# Altium project POTENCIOSTATO_REV12.PrjPcb (part 1 of 2)
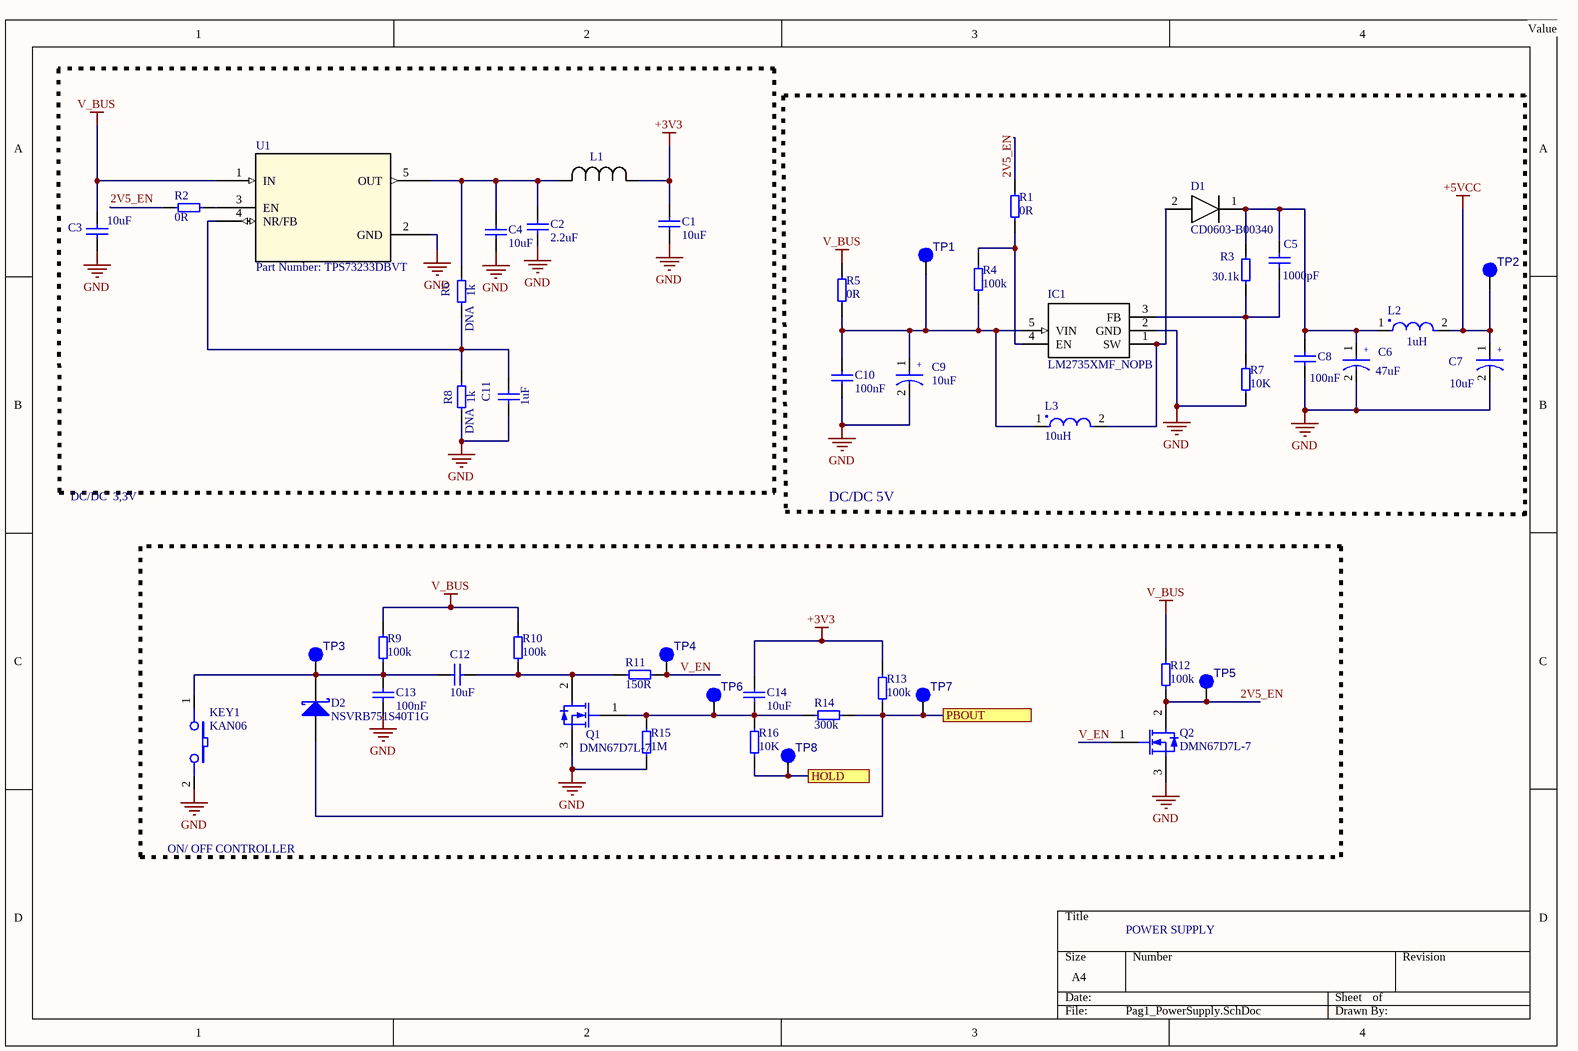
[diagram p0: Pag1_PowerSupply.SchDoc]
REFERENCIA: POTENCIOSTATO; REVISAO: REV1.2
5 sheets, 246 parts. Net scope: flat (ports and power ports of the same name join across sheets).
Board files: PCB_POTENTIOSTAT.PcbDoc, PCB_POTENTIOSTAT_P.PcbDoc
Sheets:
  Pag1_PowerSupply.SchDoc
  Pag2_Battery_Charger.SchDoc
  Pag3_Front_end_adc_dac.SchDoc
  Pag4_Processador.SchDoc
  Pag5_Perifericos.SchDoc

## Sheet Pag1_PowerSupply.SchDoc
size A4

### Parts
C1  10uF  [0603]
C2  2.2uF  [0603]
C3  10uF  [0603]
C4  10uF  [0603]
C5  1000pF  [0603]
C6  47uF  [0805]
C7  10uF  [CAP_6.6X6.6]
C8  100nF  [0603]
C9  10uF  [CAP_6.6X6.6]
C10  100nF  [0603]
C11  1uF  [0603]
C12  10uF  [0603]
C13  100nF  [0603]
C14  10uF  [0603]
D1  CD0603-B00340  [DIOM179X85N]
D2  NSVRB751S40T1G  [D_SOD523]
IC1  LM2735XMF_NOPB  [SOT95P280X145-5N]
KEY1  KAN06  [KAN06_v2]
L1  Part Number: MLZ2012A3R3WT000  [IND_2012]  (value not drawn)
L2  1uH  [SRP4012TA]
L3  10uH  [SRP4012TA]
Q1  DMN67D7L-7  [D_SOT23]
Q2  DMN67D7L-7  [D_SOT23]
R1  0R  [0603]
R2  0R  [0603]
R3  30.1k  [0603]
R4  100k  [0603]
R5  0R  [0603]
R6  1k  PCBA: DNA  [0603]
R7  10K  [0603]
R8  1k  PCBA: DNA  [0603]
R9  100k  [0603]
R10  100k  [0603]
R11  150R  [0603]
R12  100k  [0603]
R13  100k  [0603]
R14  300k  [0603]
R15  1M  [0603]
R16  10K  [0603]
TP1  Test Point  [TEST]  (value not drawn)
TP2  Test Point  [TEST]  (value not drawn)
TP3  Test Point  [TEST]  (value not drawn)
TP4  Test Point  [TEST]  (value not drawn)
TP5  Test Point  [TEST]  (value not drawn)
TP6  Test Point  [TEST]  (value not drawn)
TP7  Test Point  [TEST]  (value not drawn)
TP8  Test Point  [TEST]  (value not drawn)
U1  Part Number: TPS73233DBVT  [DBV5]

### Blocks framed on the sheet
DC/DC 5V: C5-C10 D1 IC1 L2 L3 R1 R3-R5 R7 TP1 TP2
ON/ OFF CONTROLLER: C12-C14 D2 KEY1 Q1 Q2 R9-R16 TP3-TP8

### Ports
HOLD, PBOUT

### Nets
+3V3: C1.2 C14.1 L1.1 R13.2
+5VCC: C7.1 L2.2 TP2.1(TP)
GND: C1.1 C2.1 C3.1 C4.1 C6.2 C7.2 C8.1 C9.2 C10.1 C11.1 C13.1 IC1.2(GND) KEY1.2 Q1.3(S) Q2.3(S) R7.1 R8.2 R15.2 U1.2(GND)  [project net EXT_GND_DETECT]
V_BUS: C3.2 R5.2 R9.2 R10.2 R12.2 U1.1(IN)
2V5_EN: Q2.2(D) R1.2 R2.2 R12.1 TP5.1(TP)
V_EN: Q2.1(G) R11.1 TP4.1(TP)
NetC2_2: C2.2 C4.2 L1.2 R6.1 U1.5(OUT)
NetC5_1: C5.1 IC1.3(FB) R3.1 R7.2
NetC5_2: C5.2 C6.1 C8.2 D1.1(K) L2.1 R3.2
NetC9_1: C9.1 C10.2 IC1.5(VIN) L3.1 R4.1 R5.1 TP1.1(TP)
NetC11_2: C11.2 R6.2 R8.1 U1.4(NR/FB)
NetC12_1: C12.1 Q1.2(D) R10.1 R11.2
NetC12_2: C12.2 C13.2 D2.K KEY1.1 R9.1 TP3.1(TP)
NetC14_2: C14.2 Q1.1(G) R14.1 R15.1 R16.1 TP6.1(TP)
NetD1_2: D1.2(A) IC1.1(SW) L3.2
NetD2_A: D2.A R13.1 R14.2 TP7.1(TP) ; port PBOUT
NetIC1_4: IC1.4(EN) R1.1 R4.2
NetR2_1: R2.1 U1.3(EN)
NetR16_2: R16.2 TP8.1(TP) ; port HOLD

### Notes on the sheet
- Value
- DC/DC  3,3V
- POWER SUPPLY
- (in symbol Cap Pol) +
- (in symbol Cap Pol_1) +

### Library data of the parts
C1 C4 = Cap: Multilayer Ceramic Capacitors MLCC - SMD/SMT 10uF 0603 10V 10%; Manufacturer: Murata Electronics; MPN: GRM188R61A106KE69D; PCBA: Assembly; Moeda: Dólar; NCM: 85322410; Datasheet: https://www.mouser.com/datasheet/2/281/murata_03052018_GRM_Series_1-1310166.pdf; Value: 10uF; Link/Contato: https://octopart.com/grm188r61a106ke69d-murata-22851381?r=sp; Supplier: Mouser
C2 = CAP_1uF: Multilayer Ceramic Capacitors MLCC - SMD/SMT 2.2uF 0603 16V 20%; Manufacturer: Wurth Electronics; MPN: 885012106018; PCBA: Assembly; Moeda: Dólar; NCM: 85322410; Datasheet: https://www.mouser.com/datasheet/2/445/885012106018-1727438.pdf; Value: 2.2uF; Link/Contato: https://octopart.com/885012106018-wurth+elektronik-53914723?r=sp; Supplier: Mouser
C3 = CAP_1uF: Multilayer Ceramic Capacitors MLCC - SMD/SMT 10uF 0603 10V 10%; Manufacturer: Murata Electronics; MPN: GRM188R61A106KE69D; PCBA: Assembly; Moeda: Dólar; NCM: 85322410; Datasheet: https://www.mouser.com/datasheet/2/212/KEM_C1006_X5R_SMD-1103249.pdf; Value: 10uF; Link/Contato: https://octopart.com/grm188r61a106ke69d-murata-22851381?r=sp; Supplier: Mouser
C5 = Cap_1: Capacitor Ceramic 1000pF 10% 16V 0603 (1608 Metric); MPN: 06033C102KAT2A; Manufacturer: Kyocera AVX; PCBA: Assembly; Moeda: Dólar; NCM: 85322410; Value: 1000pF; Link/Contato: https://octopart.com/06033c102kat2a-avx-2374779?r=sp; Supplier: Mouser
C6 = Cap Pol: Multilayer Ceramic Capacitors MLCC - SMD/SMT 47uF 0805 10V 20%; Manufacturer: Murata Electronics; MPN: GRM21BR61A476ME15K; PCBA: Assembly; Moeda: Dólar; NCM: 85322410; Value: 47uF; Link/Contato: https://octopart.com/grm21br61a476me15k-murata-46693540?r=sp; Supplier: Mouser
C7 C9 = Cap Pol_1: Capacitor Electrolytic 10uF 20% 16V; MPN: UUQ1C100MCL1GB; Manufacturer: Murata Electronics; PCBA: Assembly; Moeda: Dólar; NCM: 85322200; Value: 10uF; Link/Contato: https://octopart.com/uuq1c100mcl1gb-nichicon-19118150?r=sp; Supplier: Mouser
C8 C10 C13 = Cap_1: Multilayer Ceramic Capacitors MLCC - SMD/SMT 100nF 16V 0603 10%; MPN: C0603C104K4RACTU; Manufacturer: Kemet; PCBA: Assembly; Moeda: Dólar; NCM: 85322410; Value: 100nF; Link/Contato: https://octopart.com/c0603c104k4ractu-kemet-93067?r=sp; Supplier: Mouser
C11 = CAP_1uF: Multilayer Ceramic Capacitors MLCC - SMD/SMT 1uF 25V 0603 10%; Manufacturer: Samsung Electro-Mechanics; MPN: CL10A105KA8NNNC; PCBA: Assembly; Moeda: Dólar; NCM: 85322410; Datasheet: https://www.mouser.com/datasheet/2/445/885012106022-553988.pdf; Value: 1uF; Link/Contato: https://octopart.com/cl10a105ka8nnnc-samsung-9300957?r=sp; Supplier: Mouser
C12 C14 = Cap: Multilayer Ceramic Capacitors MLCC - SMD/SMT 10uF 0603 10V 10%; MPN: GRM188R61A106KE69D; Manufacturer: Murata Electronics; PCBA: Assembly; Moeda: Dólar; NCM: 85322410; Value: 10uF; Link/Contato: https://octopart.com/grm188r61a106ke69d-murata-22851381?r=sp; Supplier: Mouser
D1 = CD0603-B00340: Diode; MPN: CDBU0130R; Manufacturer: Comchip Technology; PCBA: Assembly; Moeda: Dólar; NCM: 85412120; Value: CD0603-B00340; Datasheet: https://datasheet.datasheetarchive.com/originals/distributors/Datasheets-DGA23/1390916.pdf; Link/Contato: https://octopart.com/cdbu0130r-comchip-19043158?r=sp; Supplier: Mouser
D2 = Schottky Diode: Schottky Diodes & Rectifiers SS 40V SHTKY SOD523; Manufacturer: onsemi; PCBA: Assembly; Moeda: Dólar; NCM: 85412120; MPN: NSVRB751S40T1G; Value: NSVRB751S40T1G; Link/Contato: https://octopart.com/nsvrb751s40t1g-onsemi-54318045?r=sp; Supplier: Mouser
IC1 = LM2735XMF_NOPB: Integrated Circuit; MPN: LM2735XMF/NOPB; Manufacturer: Texas Instruments; PCBA: Assembly; Moeda: Dólar; NCM: 85423120; Value: LM2735XMF_NOPB; Datasheet: http://www.ti.com/lit/ds/symlink/lm2735.pdf; Link/Contato: https://octopart.com/lm2735xmf%2Fnopb-texas+instruments-24813274?r=sp; Supplier: Mouser
KEY1 = SDS: Manufacturer: Metaltex; PCBA: Assembly; Moeda: Dólar; NCM: 85365090; Observações: Alternativo: TS11-674-73-BK-100-RA-D; Datasheet: www.metaltex.com.br/assets/produtos/pdf/a0.pdf; MPN: KAN06; Value: KAN06; Supplier: Mouser
L1 = MLZ2012A3R3WT000: No Description Available; Manufacturer: TDK; PCBA: DNA; Moeda: Dólar; NCM: 85045000; MPN: MLZ2012A3R3WT000; Datasheet: https://www.mouser.com/datasheet/2/400/nductor_commercial_decoupling_mlz2012_en-918301.pdf; Value: MLZ2012A3R3WT000; Link/Contato: https://octopart.com/mlz2012a3r3wt000-tdk-34829259?r=sp; Supplier: Mouser
L2 = IC_1uH: Power Inductors - SMD 1uH 20% SMD 4012 AEC-Q200; Manufacturer: Bourns; MPN: SRP4012TA-1R0M; PCBA: DNA; Value: 1uH 20%; Moeda: Dólar; NCM: 85045000; Datasheet: https://www.mouser.com/datasheet/2/54/rp4012ta-1391620.pdf; Link/Contato: https://octopart.com/srp4012ta-1r0m-bourns-47284976?r=sp; Supplier: Mouser
L3 = IC_1uH: Power Inductors - SMD 10uH 20% SMD 4012 AEC-Q200; Manufacturer: Bourns; MPN: SRP4012TA-100M; PCBA: Assembly; Moeda: Dólar; NCM: 85045000; Datasheet: https://www.mouser.com/datasheet/2/54/rp4012ta-1391620.pdf; Value: 10uH 20%; Link/Contato: https://octopart.com/srp4012ta-1r0m-bourns-47284976?r=sp; Supplier: Mouser
Q1 Q2 = MOSFET N-Ch: MOSFET BVDSS: 41V-60V; Manufacturer: Diodes Incorporated; PCBA: Assembly; Moeda: Dólar; NCM: 85412120; MPN: DMN67D7L-7; Value: DMN67D7L-7; Link/Contato: https://octopart.com/dmn67d7l-7-diodes+inc.-88723828?r=sp; Supplier: Mouser
R1 R5 = Res_1: Thick Film Resistors - SMD 0 Ohms 100 mW 0603 5%; MPN: RC0603JR-070RL; Manufacturer: Yageo; PCBA: Assembly; Moeda: Dólar; NCM: 85332120; Value: 0R; Link/Contato: https://octopart.com/rc0603jr-070rl-yageo-1241539?r=sp; Supplier: Mouser
R2 = Res: Thick Film Resistors - SMD 0 Ohms 100 mW 0603 5%; MPN: RC0603JR-070RL; Manufacturer: Yageo; PCBA: Assembly; Moeda: Dólar; NCM: 85332120; Value: 0R; Link/Contato: https://octopart.com/rc0603jr-070rl-yageo-1241539?r=sp; Supplier: Mouser
R3 = Res_1: Resistor Thick Film 30.1k 1% 0.1W, 1/10W 0603 (1608 metric) +/- 100 PPM / K; MPN: RC0603FR-0730K1L; Manufacturer: Yageo; PCBA: Assembly; Moeda: Dólar; NCM: 85332120; Value: 30.1k; Link/Contato: https://octopart.com/rc0603fr-0730k1l-yageo-55458484?r=sp; Supplier: Mouser
R4 = Res_1: Thick Film Resistors - SMD 100 kOhms 0603 100mW 1%; MPN: RC0603FR-07100KL; Manufacturer: Yageo; PCBA: Assembly; Moeda: Dólar; NCM: 85332120; Value: 100k; Link/Contato: https://octopart.com/rc0603fr-07100kl-yageo-40946036?r=sp; Supplier: Mouser
R6 R8 = Pullup_Res_1k_0603_RES: Thick Film Resistors - SMD 1 kOhms 100 mW 0603 5%; MPN: RC0603JR-071KL; Manufacturer: Yageo; Moeda: Dólar; NCM: 85332120; Datasheet: https://www.mouser.com/datasheet/2/447/PYu-RC_Group_51_RoHS_L_10-1527934.pdf; Value: 1K; Link/Contato: https://octopart.com/rc0603jr-071kl-yageo-55402888?r=sp; Supplier: Mouser
R7 = Res_1: Thick Film Resistors - SMD 10 kOhms 100-200 mW 0603 1%; MPN: RC0603FR-1310KL; Manufacturer: Yageo; PCBA: Assembly; Moeda: Dólar; NCM: 85332120; Value: 10K; Datasheet: https://www.mouser.com/datasheet/2/447/PYu-RC_Group_51_RoHS_L_10-1527934.pdf; Link/Contato: https://octopart.com/rc0603fr-1310kl-yageo-11543875?r=sp; Supplier: Mouser
R9 R10 = Res_1: Thick Film Resistors - SMD 100 kOhms 0603 100mW 1%; MPN: RC0603FR-07100KL; Manufacturer: YAGEO; PCBA: Assembly; Moeda: Dólar; NCM: 85332120; Value: 100k; Link/Contato: https://octopart.com/rc0603fr-07100kl-yageo-40946036?r=sp; Supplier: Mouser
R11 = Res: Thick Film Resistors - SMD 150 Ohms 0603 100mW 5%; MPN: CR0603-JW-151ELF; Manufacturer: Bourns; PCBA: Assembly; Moeda: Dólar; NCM: 85332120; Value: 150R; Link/Contato: https://octopart.com/cr0603-jw-151elf-bourns-2566617?r=sp; Supplier: Mouser
R12 R13 = Res: Thick Film Resistors - SMD 100 kOhms 0603 100mW 1%; MPN: RC0603FR-07100KL; Manufacturer: YAGEO; PCBA: Assembly; Moeda: Dólar; NCM: 85332120; Value: 100k; Link/Contato: https://octopart.com/rc0603fr-07100kl-yageo-40946036?r=sp; Supplier: Mouser
R14 = Res: Thick Film Resistors - SMD 300 kOhms 0603 100mW 1%; MPN: RC0603FR-07300KL; Manufacturer: Yageo; PCBA: Assembly; Moeda: Dólar; NCM: 85332120; Value: 300k; Link/Contato: https://octopart.com/rc0603fr-07300kl-yageo-1190095?r=sp; Supplier: Mouser
R15 = Res: Thick Film Resistors - SMD 1 MOhms 100mW 0603 1%; MPN: RC0603FR-071ML; Manufacturer: Yageo; PCBA: Assembly; Moeda: Dólar; NCM: 85332120; Value: 1M; Link/Contato: https://octopart.com/rc0603fr-071ml-yageo-1168402?r=sp; Supplier: Mouser
R16 = Res: Thick Film Resistors - SMD 10 kOhms 100-200 mW 0603 1%; MPN: RC0603FR-1310KL; Manufacturer: Yageo; PCBA: Assembly; Moeda: Dólar; NCM: 85332120; Value: 10K; Datasheet: https://www.mouser.com/datasheet/2/447/PYu-RC_Group_51_RoHS_L_10-1527934.pdf; Link/Contato: https://octopart.com/rc0603fr-1310kl-yageo-11543875?r=sp; Supplier: Mouser
TP1-TP8 = TESTPOINT: MPN: Test_Point; Manufacturer: DNA; PCBA: DNA; Value: Test Point
U1 = TPS73225DBVT: LDO Voltage Regulators Cap-Free NMOS 250mA; Manufacturer: Texas Instruments; MPN: TPS73233DBVR; PCBA: Assembly; Moeda: Dólar; NCM: 85423120; Datasheet: http://www.ti.com/lit/ds/symlink/tps732.pdf; Value: TPS73233DBVT; Link/Contato: https://octopart.com/tps73233dbvr-texas+instruments-2359245?r=sp; Supplier: Mouser

## Sheet Pag2_Battery_Charger.SchDoc: Carregador de Bateria
size A3; DocumentNumber: 1; Revision: V1.0; SheetNumber: 1; SheetTotal: 13
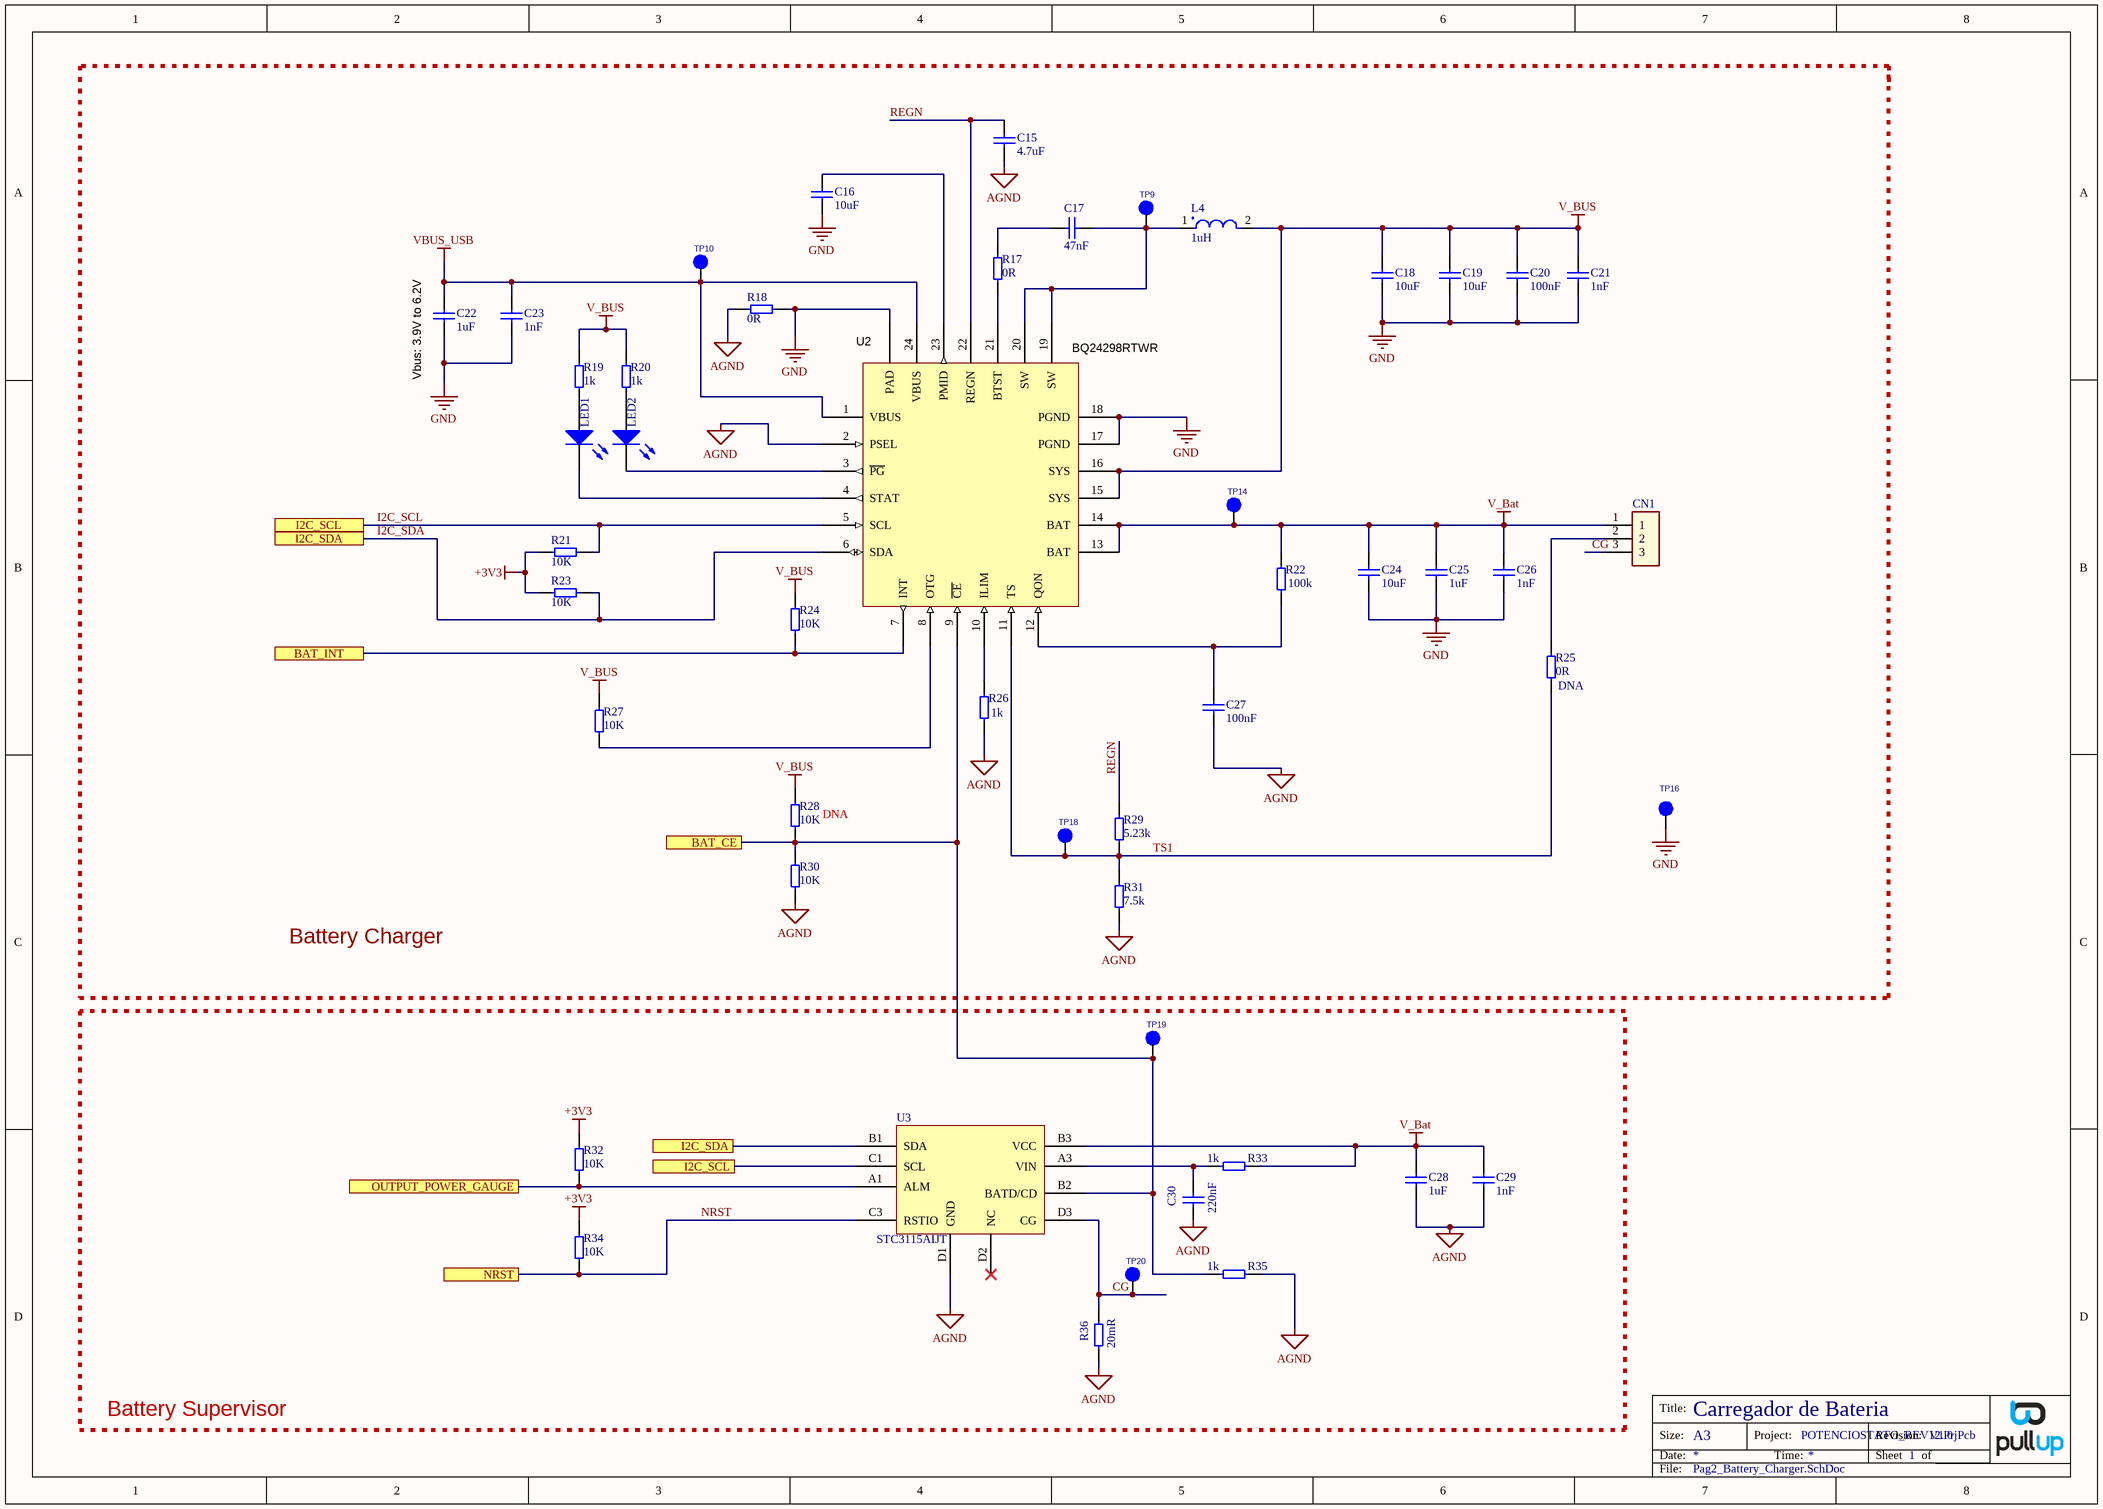
[diagram p1: Pag2_Battery_Charger.SchDoc]

### Parts
C15  4.7uF  [0603]
C16  10uF  [0603]
C17  47nF  [0603]
C18  10uF  [0603]
C19  10uF  [0603]
C20  100nF  [0603]
C21  1nF  [0603]
C22  1uF  [0603]
C23  1nF  [0603]
C24  10uF  [0603]
C25  1uF  [0603]
C26  1nF  [0603]
C27  100nF  [0603]
C28  1uF  [0603]
C29  1nF  [0603]
C30  220nF  [0603]
CN1  (no value)  [HDR1X3 Large]
L4  1uH  [SRP4012TA]
LED1  LED Green  [0603 - led]  (value not drawn)
LED2  LED Green  [0603 - led]  (value not drawn)
R17  0R  [0603]
R18  0R  [1218]
R19  1k  [0603]
R20  1k  [0603]
R21  10K  [0603]
R22  100k  [0603]
R23  10K  [0603]
R24  10K  [0603]
R25  0R  PCBA: DNA  [0603]
R26  1k  [0603]
R27  10K  [0603]
R28  10K  PCBA: DNA  [0603]
R29  5.23k  [0603]
R30  10K  [0603]
R31  7.5k  [0603]
R32  10K  [0603]
R33  1k  [0603]
R34  10K  [0603]
R35  1k  [0603]
R36  20mR  [0805]
TP9  Test_Point  [TEST]  (value not drawn)
TP10  Test_Point  [TEST]  (value not drawn)
TP14  Test_Point  [TEST]  (value not drawn)
TP16  Test_Point  [TEST]  (value not drawn)
TP18  Test_Point  [TEST]  (value not drawn)
TP19  Test_Point  [TEST]  (value not drawn)
TP20  Test_Point  [TEST]  (value not drawn)
U2  BQ24298RTWR  [WQFN-24]
U3  STC3115AIJT  [CSP1.4X2.04]

### Blocks framed on the sheet
Battery Supervisor: C28-C30 R32-R36 TP19 TP20 U3

### Ports
BAT_CE, BAT_INT, I2C_SCL, I2C_SDA, NRST, OUTPUT_POWER_GAUGE

### Nets
+3V3: R21.2 R23.2 R32.1 R34.1
AGND: C15.1 C27.1 C28.1 C29.1 C30.1 R18.1 R26.1 R30.2 R31.1 R35.1 R36.2 U2.2(PSEL) U3.D1(GND)
GND: C16.1 C18.1 C19.1 C20.1 C21.1 C22.1 C23.1 C24.1 C25.1 C26.1 R18.2 TP16.1(Pin1) U2.17(PGND) U2.18(PGND) U2.25(PAD)  [project net EXT_GND_DETECT]
V_Bat: C24.2 C25.2 C26.2 C28.2 C29.2 CN1.1 R22.1 R33.1 TP14.1(Pin1) U2.13(BAT) U2.14(BAT) U3.B3(VCC)
V_BUS: C18.2 C19.2 C20.2 C21.2 L4.2 R19.2 R20.2 R24.1 R27.1 R28.1 U2.15(SYS) U2.16(SYS)
VBUS_USB: C22.2 C23.2 TP10.1(Pin1) U2.1(VBUS) U2.24(VBUS)  [project net VBUS_USB1]
CG: CN1.3 R36.1 TP20.1(Pin1) U3.D3(CG)
I2C_SCL: R21.1 U2.5(SCL) U3.C1(SCL) ; port I2C_SCL
I2C_SDA: R23.1 U2.6(SDA) U3.B1(SDA) ; port I2C_SDA
NRST: R34.2 U3.C3(RSTIO) ; port NRST
REGN: C15.2 R29.2 U2.22(REGN)
TS1: R25.2 R29.1 R31.2 TP18.1(Pin1) U2.11(TS)
NetC16_2: C16.2 U2.23(PMID)
NetC17_1: C17.1 L4.1 TP9.1(Pin1) U2.19(SW) U2.20(SW)
NetC17_2: C17.2 R17.2
NetC27_2: C27.2 R22.2 U2.12(QON)
NetC30_2: C30.2 R33.2 U3.A3(VIN)
NetCN1_2: CN1.2 R25.1
NetLED1_1: LED1.1(A) R19.1
NetLED1_2: LED1.2(K) U2.4(STAT)
NetLED2_1: LED2.1(A) R20.1
NetLED2_2: LED2.2(K) U2.3(~{PG})
NetR17_1: R17.1 U2.21(BTST)
NetR24_2: R24.2 U2.7(INT) ; port BAT_INT
NetR26_2: R26.2 U2.10(ILIM)
NetR27_2: R27.2 U2.8(OTG)
NetR28_2: R28.2 R30.1 R35.2 TP19.1(Pin1) U2.9(~{CE}) U3.B2(BATD/CD) ; port BAT_CE
NetR32_2: R32.2 U3.A1(ALM) ; port OUTPUT_POWER_GAUGE

Not connected (* = marked no-connect by the designer): U3 D2(NC)*

### Notes on the sheet
- (near C22) Vbus: 3.9V to 6.2V
- Battery Charger
- Title:
- Size:
- Date:
- A3
- Project:
- Time:
- Revision:
- Sheet
- of
- File:

### Library data of the parts
C15 = CAP_4.7uF_16V: Multilayer Ceramic Capacitors MLCC - SMD/SMT 4.7uF 6.3V 0603 10%; Manufacturer: Taiyo Yuden; MPN: JMK105BBJ475MV-F; PCBA: Assembly; Moeda: Dólar; NCM: 85322410; Datasheet: https://www.mouser.com/datasheet/2/396/mlcc02_e-1307760.pdf; Value: 4.7uF; Link/Contato: https://octopart.com/jmk105bbj475mv-f-taiyo+yuden-19756710?r=sp; Supplier: Mouser
C16 C18 C19 C24 = CAP_10uF_10V: Multilayer Ceramic Capacitors MLCC - SMD/SMT 10uF 0603 10V 10%; Manufacturer: Murata Electronics; MPN: GRM188R61A106KE69D; PCBA: Assembly; Moeda: Dólar; NCM: 85322410; Datasheet: http://www.mouser.com/ds/2/281/c02e-2905.pdf; Value: 10uF; Link/Contato: https://octopart.com/grm188r61a106ke69d-murata-22851381?r=sp; Supplier: Mouser
C17 = CAP_4.7uF_16V: Multilayer Ceramic Capacitors MLCC - SMD/SMT 47nF 0603 16V 10%; Manufacturer: AVX; MPN: 0603YC473KAT2A; PCBA: Assembly; Moeda: Dólar; NCM: 85322410; Datasheet: http://www.mouser.com/ds/2/40/X7RDielectric-777024.pdf; Value: 47nF; Link/Contato: https://octopart.com/0603yc473kat2a-avx-42088465?r=sp; Supplier: Mouser
C20 C27 = CAP_100nF_10V: Multilayer Ceramic Capacitors MLCC - SMD/SMT 100nF 16V 0603 10%; Manufacturer: KEMET; MPN: C0603C104K4RACTU; PCBA: Assembly; Moeda: Dólar; NCM: 85322410; Datasheet: https://www.mouser.com/datasheet/2/212/KEM_C1023_X7R_AUTO_SMD-1093309.pdf; Value: 100nF; Link/Contato: https://octopart.com/c0603c104k4ractu-kemet-93067?r=sp; Supplier: Mouser
C21 C26 = CAP_1nF_16V: Multilayer Ceramic Capacitors MLCC - SMD/SMT 25V 1nF 0603 25V 5%; Manufacturer: Yageo; MPN: CC0603JRX7R8BB102; PCBA: Assembly; Moeda: Dólar; NCM: 85322410; Datasheet: https://www.mouser.com/datasheet/2/447/UPY-GPHC_X7R_6.3V-to-50V_18-1154002.pdf; Value: 1nF; Link/Contato: https://octopart.com/cc0603jrx7r8bb102-yageo-71334465?r=sp; Supplier: Mouser
C22 C28 = CAP_1uF: as C11 on sheet Pag1_PowerSupply; Datasheet: https://www.mouser.com/datasheet/2/585/MLCC-1837944.pdf; Value: 1uF; Link/Contato: https://octopart.com/cl10a105ka8nnnc-samsung-9300957?r=sp; Supplier: Mouser
C23 C29 = CAP_1nF: Multilayer Ceramic Capacitors MLCC - SMD/SMT 25V 1nF 0603 25V 5%; Manufacturer: Yageo; MPN: CC0603JRX7R8BB102; PCBA: Assembly; Moeda: Dólar; NCM: 85322410; Datasheet: https://www.mouser.com/datasheet/2/447/UPY-GPHC_X7R_6.3V-to-50V_18-1154002.pdf; Value: 1nF; Link/Contato: https://octopart.com/cc0603jrx7r8bb102-yageo-71334465?r=sp; Supplier: Mouser
C25 = CAP_1uF_16V: Multilayer Ceramic Capacitors MLCC - SMD/SMT 1uF 25V 0603 10%; Manufacturer: Samsung Electro-Mechanics; MPN: CL10A105KA8NNNC; PCBA: Assembly; Moeda: Dólar; NCM: 85322410; Datasheet: https://www.mouser.com/datasheet/2/585/MLCC-1837944.pdf; Value: 1uF; Link/Contato: https://octopart.com/cl10a105ka8nnnc-samsung-9300957?r=sp; Supplier: Mouser
C30 = CAP_1nF: Multilayer Ceramic Capacitors MLCC - SMD/SMT 220nF 0603 16V 10%; Manufacturer: Yageo; MPN: CC0603KRX7R7BB224; PCBA: Assembly; Moeda: Dólar; NCM: 85322410; Datasheet: https://www.mouser.com/datasheet/2/447/UPY-GPHC_X7R_6.3V-to-50V_18-1154002.pdf; Value: 220nF; Link/Contato: https://octopart.com/cc0603krx7r7bb224-yageo-6827757?r=sp; Supplier: Mouser
CN1 = 53254-0370: MPN: Header; PCBA: DNA; Value: DNA; NCM: 85366990
L4 = IC_1uH: Power Inductors - SMD 1uH 20% SMD 4012 AEC-Q200; Manufacturer: Bourns; MPN: SRP4012TA-1R0M; PCBA: Assembly; Value: 1uH 20%; Moeda: Dólar; NCM: 85045000; Datasheet: https://www.mouser.com/datasheet/2/54/rp4012ta-1391620.pdf; Link/Contato: https://octopart.com/srp4012ta-1r0m-bourns-47284976?r=sp; Supplier: Mouser
LED1 LED2 = CDE02104-C024: Standard LEDs - SMD Green, Water Clear 60mcd, 571nm; MPN: APG1608CGKC/T; Manufacturer: Kingbright; PCBA: Assembly; Value: APG1608CGKC/T; Moeda: Dólar; NCM: 85414121; Datasheet: http://www.mouser.com/ds/2/216/APG1608CGKC-T-76846.pdf; Link/Contato: https://octopart.com/apg1608cgkc%2Ft-kingbright-18895116?r=sp; Supplier: Mouser
R17 = Pullup_Res_0_0603_RES: Thick Film Resistors - SMD 0 Ohms 100 mW 0603 5%; MPN: RC0603JR-070RL; Manufacturer: Yageo; PCBA: Assembly; Moeda: Dólar; NCM: 85332120; Datasheet: https://www.mouser.com/datasheet/2/447/PYu-RC_Group_51_RoHS_L_10-1527934.pdf; Value: 0R; Link/Contato: https://octopart.com/rc0603jr-070rl-yageo-1241539?r=sp; Supplier: Mouser
R18 = RES_0R_1218: Thick Film Resistors - SMD 1watt zero ohm 1218; Manufacturer: Yageo; MPN: RCL12180000Z0EK; PCBA: Assembly; Moeda: Dólar; NCM: 85332120; Datasheet: http://www.mouser.com/ds/2/447/PYu-RC1218_51_RoHS_L_(3)-2499.pdf; Value: 0R; Link/Contato: https://octopart.com/rcl12180000z0ek-vishay-44522010?r=sp; Supplier: Mouser
R19 R20 R26 R33 R35 = Pullup_Res_1k_0603_RES: Thick Film Resistors - SMD 1 kOhms 100 mW 0603 5%; MPN: RC0603JR-071KL; Manufacturer: Yageo; PCBA: Assembly; Moeda: Dólar; NCM: 85332120; Datasheet: https://www.mouser.com/datasheet/2/447/PYu-RC_Group_51_RoHS_L_10-1527934.pdf; Value: 1K; Link/Contato: https://octopart.com/rc0603jr-071kl-yageo-55402888?r=sp; Supplier: Mouser
R21 R23 R24 R27 R30 R32 R34 = RES_10k: Thick Film Resistors - SMD 10 kOhms 100-200 mW 0603 1%; Manufacturer: Yageo; MPN: RC0603FR-1310KL; PCBA: Assembly; Moeda: Dólar; NCM: 85332120; Datasheet: https://www.mouser.com/datasheet/2/427/crcwce3-1223726.pdf; Value: 10K; Link/Contato: https://octopart.com/rc0603fr-1310kl-yageo-11543875?r=sp; Supplier: Mouser
R22 = Pullup_Res_100K_0603_RES: Thick Film Resistors - SMD 100 kOhms 0603 100mW 1%; MPN: RC0603FR-07100KL; Manufacturer: Yageo; PCBA: Assembly; Moeda: Dólar; NCM: 85332120; Datasheet: https://www.mouser.com/datasheet/2/447/PYu-RC_Group_51_RoHS_L_10-1527934.pdf; Value: 100k; Link/Contato: https://octopart.com/rc0603fr-07100kl-yageo-40946036?r=sp; Supplier: Mouser
R25 = Pullup_Res_0_0603_RES: Thick Film Resistors - SMD 0 Ohms 100 mW 0603 5%; MPN: RC0603JR-070RL; Manufacturer: Yageo; Moeda: Dólar; NCM: 85332120; Datasheet: https://www.mouser.com/datasheet/2/447/PYu-RC_Group_51_RoHS_L_10-1527934.pdf; Value: 0R; Link/Contato: https://octopart.com/rc0603jr-070rl-yageo-1241539?r=sp; Supplier: Mouser
R28 = RES_10k: Thick Film Resistors - SMD 10 kOhms 100-200 mW 0603 1%; Manufacturer: Yageo; MPN: RC0603FR-1310KL; Moeda: Dólar; NCM: 85332120; Datasheet: https://www.mouser.com/datasheet/2/427/crcwce3-1223726.pdf; Value: 10K; Link/Contato: https://octopart.com/rc0603fr-1310kl-yageo-11543875?r=sp; Supplier: Mouser
R29 = RES_5.23k: Thick Film Resistors - SMD 5.23 kOhms 100mW 0603 1%; Manufacturer: KOA; MPN: RK73H1JTTD5231F; PCBA: Assembly; Moeda: Dólar; NCM: 85332120; Datasheet: http://www.mouser.com/ds/2/219/RK73H-5715.pdf; Value: 5.23k; Link/Contato: https://octopart.com/rk73h1jttd5231f-koa+speer-2167069?r=sp; Supplier: Mouser
R31 = RES_31.6k: Thick Film Resistors - SMD 7.5 kOhms 100mW 0603 0.1%; Manufacturer: KOA Speer; MPN: RN73R1JTTD7501B25; PCBA: Assembly; Moeda: Dólar; NCM: 85332120; Datasheet: https://br.mouser.com/datasheet/2/219/RN73R-1544889.pdf; Value: 7.5k; Link/Contato: https://octopart.com/rn73r1jttd7501b25-koa+speer-99548049?r=sp; Supplier: Mouser
R36 = Pullup_Res_1k_0603_RES: Current Sense Resistors - SMD .20mOhm 1% 1/2W; MPN: CFN0603-FX-R020ELF; Manufacturer: Bourns; PCBA: Assembly; Moeda: Dólar; NCM: 85332120; Datasheet: https://br.mouser.com/datasheet/2/447/yageodocoutput-1518764.pdf; Value: 20mR; Link/Contato: https://octopart.com/cfn0603-fx-r020elf-bourns-118067148?r=sp; Supplier: Mouser
TP9 TP10 TP14 TP16 TP18-TP20 = CDO08200-9892: Manufacturer: DNA; Value: Test Point; MPN: Test_Point; PCBA: DNA
U2 = IC_BQ24298RTWT: Battery Management I2C Controlled Single Cell 3A USB Charger with NVDC Power Path and Adjustable Voltage USB OTG 24-WQFN; Manufacturer: Texas Instruments; PCBA: Assembly; Moeda: Dólar; NCM: 85423120; MPN: BQ24298RTWR; Datasheet: http://www.ti.com/general/docs/suppproductinfo.tsp?distId=26&gotoUrl=http%3A%2F%2Fwww.ti.com%2Flit%2Fgpn%2Fbq24298; Value: BQ24298RTWR; Link/Contato: https://octopart.com/bq24298rtwr-texas+instruments-57441481?r=sp; Supplier: Mouser
U3 = STC3100: Battery Management CONDITIONING & INTERFACES; Manufacturer: STMicroelectronics; PCBA: Assembly; Moeda: Dólar; NCM: 85423120; Datasheet: https://br.mouser.com/datasheet/2/389/stc3115-974248.pdf; MPN: STC3115AIJT; Value: STC3115AIJT; Link/Contato: https://octopart.com/stc3115aijt-stmicroelectronics-29487915?r=sp; Supplier: Mouser

## Sheet Pag3_Front_end_adc_dac.SchDoc
size A4
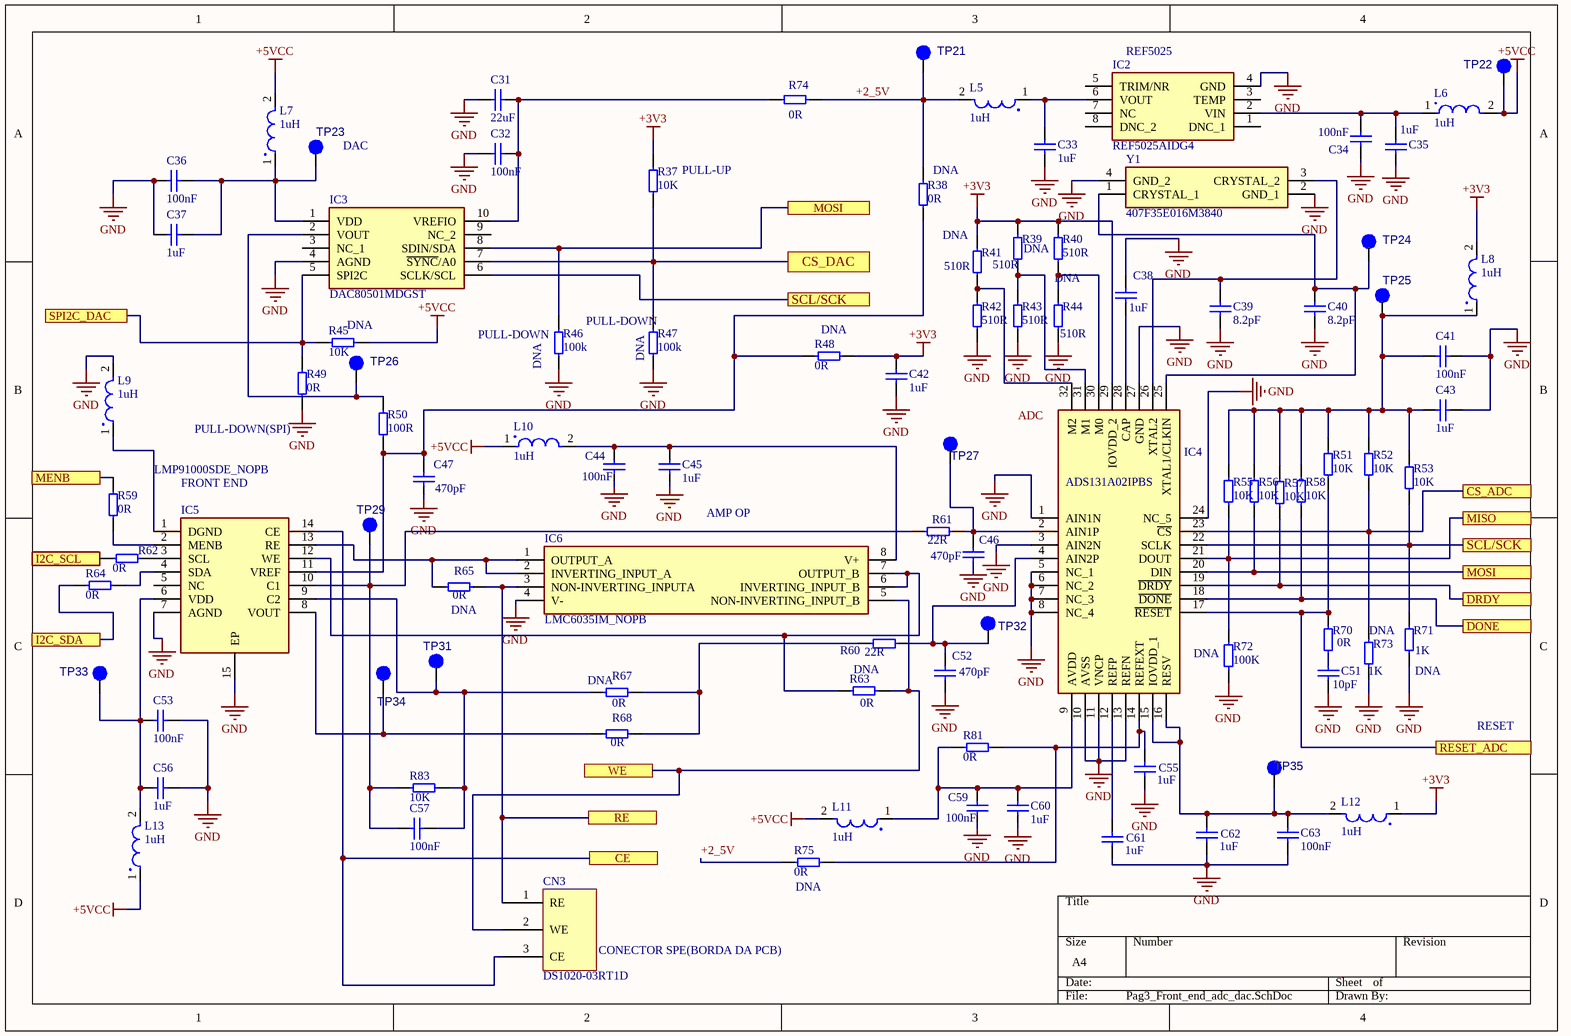
[diagram p2: Pag3_Front_end_adc_dac.SchDoc]

### Parts
C31  22uF  [0603]
C32  100nF  [0603]
C33  1uF  [0603]
C34  100nF  [0603]
C35  1uF  [0603]
C36  100nF  [0603]
C37  1uF  [0603]
C38  1uF  [0603]
C39  8.2pF  [0603]
C40  8.2pF  [0603]
C41  100nF  [0603]
C42  1uF  [0603]
C43  1uF  [0603]
C44  100nF  [0603]
C45  1uF  [0603]
C46  470pF  [0603]
C47  470pF  [0603]
C51  10pF  [0603]
C52  470pF  [0603]
C53  100nF  [0603]
C55  1uF  [0603]
C56  1uF  [0603]
C57  100nF  [0603]
C59  100nF  [0603]
C60  1uF  [0603]
C61  1uF  [0603]
C62  1uF  [0603]
C63  100nF  [0603]
CN3  DS1020-03RT1D  [DS1020-03RT1D]
IC2  REF5025AIDG4  [SOIC127P600X175-8N]
IC3  DAC80501MDGST  [SOP50P490X110-10N]
IC4  ADS131A02IPBS  [QFP50P700X700X120-32N]
IC5  LMP91000SDE_NOPB  [SON50P400X400X80-15N]
IC6  LMC6035IM_NOPB  [SOIC127P600X175-8N]
L5  1uH  [SRP4012TA]
L6  1uH  [SRP4012TA]
L7  1uH  [SRP4012TA]
L8  1uH  [SRP4012TA]
L9  1uH  [SRP4012TA]
L10  1uH  [SRP4012TA]
L11  1uH  [SRP4012TA]
L12  1uH  [SRP4012TA]
L13  1uH  [SRP4012TA]
R37  10K  [0603]
R38  0R  PCBA: DNA  [0603]
R39  PCBA: DNA  [0603]  (hidden comment: 510R)
R40  510R  [0603]
R41  510R  PCBA: DNA  [0603]
R42  510R  [0603]
R43  510R  [0603]
R44  PCBA: DNA  [0603]  (hidden comment: 510R)
R45  10K  PCBA: DNA  [0603]
R46  100k  [0603]
R47  100k  [0603]
R48  0R  PCBA: DNA  [0603]
R49  0R  [0603]
R50  100R  [0603]
R51  10K  [0603]
R52  10K  [0603]
R53  10K  [0603]
R55  10K  [0603]
R56  10K  [0603]
R57  10K  [0603]
R58  10K  [0603]
R59  0R  [0603]
R60  22R  [0603]
R61  22R  [0603]
R62  0R  [0603]
R63  0R  PCBA: DNA  [0603]
R64  0R  [0603]
R65  0R  PCBA: DNA  [0603]
R67  0R  PCBA: DNA  [0603]
R68  0R  [0603]
R70  0R  [0603]
R71  PCBA: DNA  [0603]  (hidden comment: 1K)
R72  100K  PCBA: DNA  [0603]
R73  PCBA: DNA  [0603]  (hidden comment: 1K)
R74  0R  [0603]
R75  0R  PCBA: DNA  [0603]
R81  0R  [0603]
R83  10K  [0603]
TP21  Test Point  [TEST]  (value not drawn)
TP22  Test Point  [TEST]  (value not drawn)
TP23  Test Point  [TEST]  (value not drawn)
TP24  Test Point  [TEST]  (value not drawn)
TP25  Test Point  [TEST]  (value not drawn)
TP26  Test Point  [TEST]  (value not drawn)
TP27  Test Point  [TEST]  (value not drawn)
TP29  Test Point  [TEST]  (value not drawn)
TP31  Test Point  [TEST]  (value not drawn)
TP32  Test Point  [TEST]  (value not drawn)
TP33  Test Point  [TEST]  (value not drawn)
TP34  Test Point  [TEST]  (value not drawn)
TP35  Test Point  [TEST]  (value not drawn)
Y1  407F35E016M3840  [407F35E016M3840]

### Ports
CE, CS_ADC, CS_DAC, DONE, DRDY, I2C_SCL, I2C_SDA, MENB, MISO, MOSI, RE, RESET_ADC, SCL/SCK, SPI2C_DAC, WE

### Nets
+3V3: C42.2 IC4.29(IOVDD_2) L8.2 L12.1 R37.2 R39.2 R40.2 R41.2 R48.2
+5VCC: L6.2 L7.2 L10.1 L11.2 L13.1 R45.1 TP22.1(TP)
GND: C31.1 C32.2 C33.1 C34.1 C35.1 C36.1 C37.2 C38.2 C39.1 C40.1 C41.2 C42.1 C43.1 C44.1 C45.2 C46.1 C47.1 C51.1 C52.1 C53.2 C55.1 C56.1 C59.1 C60.1 C61.1 C62.1 C63.1 IC2.4(GND) IC3.4(AGND) IC4.1(AIN1N) IC4.3(AIN2N) IC4.5(NC_1) IC4.6(NC_2) IC4.7(NC_3) IC4.8(NC_4) IC4.10(AVSS) IC4.11(VNCP) IC4.13(REFN) IC4.24(NC_5) IC4.27(GND) IC5.7(AGND) IC5.15(EP) IC6.4(V-) L9.2 R42.1 R43.1 R44.1 R46.1 R47.1 R49.1 R71.1 R72.1 R73.1 Y1.2(GND_1) Y1.4(GND_2)  [project net EXT_GND_DETECT]
+2_5V: L5.2 R38.2 R74.1 R75.2 TP21.1(TP)
I2C_SCL: R62.2 ; port I2C_SCL
I2C_SDA: R64.2 ; port I2C_SDA
NetC31_2: C31.2 C32.1 IC3.10(VREFIO) R74.2
NetC33_2: C33.2 IC2.6(VOUT) L5.1
NetC34_2: C34.2 C35.2 IC2.2(VIN) L6.1
NetC36_2: C36.2 C37.1 IC3.1(VDD) L7.1 TP23.1(TP)
NetC38_1: C38.1 IC4.28(CAP)
NetC39_2: C39.2 IC4.26(XTAL2) Y1.3(CRYSTAL_2)
NetC40_2: C40.2 IC4.25(XTAL1/CLKIN) TP24.1(TP) Y1.1(CRYSTAL_1)
NetC41_1: C41.1 C43.2 L8.1 R51.2 R52.2 R53.2 R55.2 R56.2 R57.2 R58.2 TP25.1(TP)
NetC44_2: C44.2 C45.1 IC6.8(V+) L10.2
NetC46_2: C46.2 IC4.2(AIN1P) R61.2 TP27.1(TP)
NetC47_2: C47.2 IC5.11(VREF) R38.1 R48.1 R50.1
NetC51_2: C51.2 R70.1
NetC52_2: C52.2 IC4.4(AIN2P) R60.2 TP32.1(TP)
NetC53_1: C53.1 C56.2 IC5.6(VDD) L13.2 TP33.1(TP)
NetC55_2: C55.2 IC4.14(REFEXT) R75.1 R81.1
NetC57_1: C57.1 IC5.10(C1) R61.1 R83.2 TP29.1(TP)
NetC57_2: C57.2 IC5.9(C2) R67.2 R83.1 TP31.1(TP)
NetC59_2: C59.2 C60.2 IC4.9(AVDD) L11.1 R81.2
NetC61_2: C61.2 IC4.12(REFP)
NetC62_2: C62.2 C63.2 IC4.15(IOVDD_1) IC4.16(RESV) L12.2 TP35.1(TP)
NetCN3_1: CN3.1(RE) IC6.3(NON-INVERTING_INPUTA) R65.1 ; port RE
NetCN3_2: CN3.2(WE) IC6.5(NON-INVERTING_INPUT_B) R63.1 ; port WE
NetCN3_3: CN3.3(CE) IC5.14(CE) ; port CE
NetIC3_2: IC3.2(VOUT) R50.2 TP26.1(TP)
NetIC3_5: IC3.5(SPI2C) R45.2 R49.2 ; port SPI2C_DAC
NetIC3_6: IC3.6(SCLK/SCL) IC4.22(SCLK) R53.1 R71.2 ; port SCL/SCK
NetIC3_7: IC3.7(~{SYNC}/A0) R37.1 R47.2 ; port CS_DAC
NetIC3_8: IC3.8(SDIN/SDA) IC4.20(DIN) R46.2 R56.1 ; port MOSI
NetIC4_17: IC4.17(~{RESET}) R51.1 R70.2 ; port RESET_ADC
NetIC4_18: IC4.18(~{DONE}) R58.1 ; port DONE
NetIC4_19: IC4.19(~{DRDY}) R57.1 ; port DRDY
NetIC4_21: IC4.21(DOUT) R55.1 R72.2 ; port MISO
NetIC4_23: IC4.23(~{CS}) R52.1 R73.2 ; port CS_ADC
NetIC4_30: IC4.30(M0) R40.1 R44.2
NetIC4_31: IC4.31(M1) R39.1 R43.2
NetIC4_32: IC4.32(M2) R41.1 R42.2
NetIC5_1: IC5.1(DGND) L9.1
NetIC5_2: IC5.2(MENB) R59.1
NetIC5_3: IC5.3(SCL) R62.1
NetIC5_4: IC5.4(SDA) R64.1
NetIC5_8: IC5.8(VOUT) R68.2 TP34.1(TP)
NetIC5_12: IC5.12(WE) IC6.6(INVERTING_INPUT_B) IC6.7(OUTPUT_B) R63.2
NetIC5_13: IC5.13(RE) IC6.1(OUTPUT_A) IC6.2(INVERTING_INPUT_A) R65.2
NetIC8_11: R59.2 ; port MENB
NetR60_1: R60.1 R67.1 R68.1

Not connected (* = marked no-connect by the designer): IC2 1(DNC_1) 3(TEMP) 5(TRIM/NR) 7(NC) 8(DNC_2); IC3 3(NC_1) 9(NC_2); IC5 5(NC)

### Notes on the sheet
- (near IC2) REF5025
- (near TP23) DAC
- (near R37) PULL-UP
- (near R46) PULL-DOWN
- (near R46) DNA
- (near R47) PULL-DOWN
- (near R47) DNA
- (near R49) PULL-DOWN(SPI)
- (near IC5) FRONT END
- AMP OP
- RESET
- CONECTOR SPE(BORDA DA PCB)
- Labels drawn without touching a wire or pin: ADC

### Library data of the parts
C31 = CAP_10uF_10V: Multilayer Ceramic Capacitors MLCC - SMD/SMT 22uF 0603 6.3V 20%; Manufacturer: KEMET; MPN: C0603C226M9PACTU; PCBA: Assembly; Moeda: Dólar; NCM: 85322410; Datasheet: http://www.mouser.com/ds/2/281/c02e-2905.pdf; Value: 22uF; Link/Contato: https://octopart.com/c0603c226m9pactu-kemet-109693077?r=sp; Supplier: Mouser
C32 C34 C36 C41 C44 C53 C57 C59 C63 = Cap_1: as C8 on sheet Pag1_PowerSupply; Value: 100nF; Link/Contato: https://octopart.com/c0603c104k4ractu-kemet-93067?r=sp; Supplier: Mouser
C33 C35 C37 C38 C42 C43 C45 C55 C56 C60-C62 = CAP_1uF: as C11 on sheet Pag1_PowerSupply; Datasheet: https://www.mouser.com/datasheet/2/585/MLCC-1837944.pdf; Value: 1uF; Link/Contato: https://octopart.com/cl10a105ka8nnnc-samsung-9300957?r=sp; Supplier: Mouser
C39 C40 = Cap_1_1: Multilayer Ceramic Capacitors MLCC - SMD/SMT 8.2pF 0603 16V 0.25pF; MPN: C0603C829C4GACAUTO; Manufacturer: Kemet; PCBA: Assembly; Moeda: Dólar; NCM: 85322410; Value: 8.2pF; Link/Contato: https://octopart.com/c0603c829c4gacauto-kemet-108099791?r=sp; Supplier: Mouser
C46 C52 = CAP_100nF_10V: Multilayer Ceramic Capacitors MLCC - SMD/SMT 470pF 0603 25V 5%; Manufacturer: Kyocera AVX; MPN: 06033A471JAT2A; PCBA: DNA; Moeda: Dólar; NCM: 85322410; Datasheet: https://www.mouser.com/datasheet/2/212/KEM_C1023_X7R_AUTO_SMD-1093309.pdf; Value: 470pF; Link/Contato: https://octopart.com/06033a471jat2a-kyocera+avx-71036351?r=sp; Supplier: Mouser
C47 = CAP_100nF_10V: Multilayer Ceramic Capacitors MLCC - SMD/SMT 470pF 0603 25V 5%; Manufacturer: Kyocera AVX; MPN: 06033A471JAT2A; PCBA: Assembly; Moeda: Dólar; NCM: 85322410; Datasheet: https://www.mouser.com/datasheet/2/212/KEM_C1023_X7R_AUTO_SMD-1093309.pdf; Value: 470pF; Link/Contato: https://octopart.com/06033a471jat2a-kyocera+avx-71036351?r=sp; Supplier: Mouser
C51 = Cap_1_1: Multilayer Ceramic Capacitors MLCC - SMD/SMT 10pF 0603 16V 10%; MPN: 0603YD100KAT2A; Manufacturer: Kyocera AVX; PCBA: Assembly; Moeda: Dólar; NCM: 85322410; Value: 10pF; Link/Contato: https://octopart.com/0603yd100kat2a-kyocera+avx-122048797?r=sp; Supplier: Mouser
CN3 = DS1020-03RT1D: Connector: FFC/FPC; angled 90°; PIN: 3; Non-ZIF; THT; tinned; 20mΩ; Manufacturer: Connfly; PCBA: Assembly; Moeda: Dólar; NCM: 85366990; MPN: DS1020-03RT1D; Value: DS1020-03RT1D; Link/Contato: https://octopart.com/ds1020-03rt1d-connfly-30735942?r=sp; Supplier: Mouser
IC2 = REF5025AIDG4: Integrated Circuit; Manufacturer: Texas Instruments; PCBA: Assembly; Moeda: Dólar; NCM: 85423120; MPN: REF5025AIDG4; Value: REF5025AIDG4; Datasheet: https://www.ti.com/lit/ds/symlink/ref5020.pdf?HQS=TI-null-null-digikeymode-df-pf-null-wwe&ts=1600155491186; Link/Contato: https://octopart.com/ref5025aidg4-texas+instruments-7108023?r=sp; Supplier: Mouser
IC3 = DAC80501MDGST: Integrated Circuit; Manufacturer: Texas Instruments; PCBA: Assembly; Moeda: Dólar; NCM: 85423120; MPN: DAC80501MDGST; Value: DAC80501MDGST; Datasheet: https://www.ti.com/lit/gpn/DAC80501; Link/Contato: https://octopart.com/dac80501mdgst-texas+instruments-103245318?r=sp; Supplier: Mouser
IC4 = ADS131A02IPBS: Integrated Circuit; Manufacturer: Texas Instruments; PCBA: Assembly; Moeda: Dólar; NCM: 85423120; MPN: ADS131A02IPBS; Value: ADS131A02IPBS; Datasheet: http://www.ti.com/lit/gpn/ADS131A02; Link/Contato: https://octopart.com/ads131a02ipbsr-texas+instruments-75117683?r=sp; Supplier: Mouser
IC5 = LMP91000SDE_NOPB: Integrated Circuit; MPN: LMP91000SDE/NOPB; Manufacturer: Texas Instruments; PCBA: Assembly; Moeda: Dólar; NCM: 85423120; Value: LMP91000SDE_NOPB; Datasheet: http://www.ti.com/lit/ds/symlink/lmp91000.pdf; Link/Contato: https://octopart.com/lmp91000sde%2Fnopb-texas+instruments-24815749?r=sp; Supplier: Mouser
IC6 = LMC6035IM_NOPB: Integrated Circuit; Manufacturer: Texas Instruments; MPN: LMC6035IM/NOPB; Value: LMC6035IM/NOPB; PCBA: DNA; Moeda: Dólar; NCM: 85423120; Datasheet: http://www.ti.com/lit/ds/symlink/lmc6035.pdf; Link/Contato: https://octopart.com/lmc6035imx%2Fnopb-texas+instruments-24815243?r=sp; Supplier: Mouser
L5-L9 L11-L13 = IC_1uH: as L4 on sheet Pag2_Battery_Charger; Datasheet: https://www.mouser.com/datasheet/2/54/rp4012ta-1391620.pdf; Link/Contato: https://octopart.com/srp4012ta-1r0m-bourns-47284976?r=sp; Supplier: Mouser
L10 = IC_1uH: as L2 on sheet Pag1_PowerSupply; Datasheet: https://www.mouser.com/datasheet/2/54/rp4012ta-1391620.pdf; Link/Contato: https://octopart.com/srp4012ta-1r0m-bourns-47284976?r=sp; Supplier: Mouser
R37 R51 R52 R55-R58 = Pullup_Res_100K_0603_RES: Thick Film Resistors - SMD 10 kOhms 100-200 mW 0603 1%; MPN: RC0603FR-1310KL; Manufacturer: Yageo; PCBA: Assembly; Moeda: Dólar; NCM: 85332120; Datasheet: https://www.mouser.com/datasheet/2/427/crcwce3-1223726.pdf; Value: 10K; Link/Contato: https://octopart.com/rc0603fr-1310kl-yageo-11543875?r=sp; Supplier: Mouser
R38 R48 = Pullup_Res_100K_0603_RES: Thick Film Resistors - SMD 0 Ohms 100 mW 0603 5%; MPN: RC0603JR-070RL; Manufacturer: Yageo; Moeda: Dólar; NCM: 85332120; Datasheet: https://www.mouser.com/datasheet/2/447/PYu-RC_Group_51_RoHS_L_10-1527934.pdf; Value: 0R; Link/Contato: https://octopart.com/rc0603jr-070rl-yageo-1241539?r=sp; Supplier: Mouser
R39 R41 R44 = Pullup_Res_0_0603_RES: Thick Film Resistors - SMD 510 Ohms 0603 100mW 1%; MPN: RC0603FR-13510RL; Manufacturer: Yageo; Moeda: Dólar; NCM: 85332120; Datasheet: https://www.mouser.com/datasheet/2/447/PYu-RC_Group_51_RoHS_L_10-1527934.pdf; Value: 510R; Link/Contato: https://octopart.com/rc0603fr-13510rl-yageo-26129952?r=sp; Supplier: Mouser
R40 R42 R43 = Pullup_Res_0_0603_RES: Thick Film Resistors - SMD 510 Ohms 0603 100mW 1%; MPN: RC0603FR-13510RL; Manufacturer: Yageo; PCBA: Assembly; Moeda: Dólar; NCM: 85332120; Datasheet: https://www.mouser.com/datasheet/2/447/PYu-RC_Group_51_RoHS_L_10-1527934.pdf; Value: 510R; Link/Contato: https://octopart.com/rc0603fr-13510rl-yageo-26129952?r=sp; Supplier: Mouser
R45 = Pullup_Res_100K_0603_RES: Thick Film Resistors - SMD 10 kOhms 100-200 mW 0603 1%; MPN: RC0603FR-1310KL; Manufacturer: Yageo; Moeda: Dólar; NCM: 85332120; Datasheet: https://www.mouser.com/datasheet/2/427/crcwce3-1223726.pdf; Value: 10K; Link/Contato: https://octopart.com/rc0603fr-1310kl-yageo-11543875?r=sp; Supplier: Mouser
R46 R47 = Pullup_Res_100K_0603_RES: Thick Film Resistors - SMD 100 kOhms 0603 100mW 1%; MPN: RC0603FR-07100KL; Manufacturer: Yageo; PCBA: DNA; Moeda: Dólar; NCM: 85332120; Datasheet: https://www.mouser.com/datasheet/2/447/PYu-RC_Group_51_RoHS_L_10-1527934.pdf; Value: 100k; Link/Contato: https://octopart.com/rc0603fr-07100kl-yageo-40946036?r=sp; Supplier: Mouser
R49 R59 R62 R64 R68 R70 R74 R81 = Pullup_Res_0_0603_RES: as R17 on sheet Pag2_Battery_Charger; Datasheet: https://www.mouser.com/datasheet/2/447/PYu-RC_Group_51_RoHS_L_10-1527934.pdf; Value: 0R; Link/Contato: https://octopart.com/rc0603jr-070rl-yageo-1241539?r=sp; Supplier: Mouser
R50 = Pullup_Res_0_0603_RES: Thick Film Resistors - SMD 100 Ohms 0603 100mW 1%; MPN: ERJ-3EKF1000V; Manufacturer: Panasonic; PCBA: Assembly; Moeda: Dólar; NCM: 85332120; Value: 100R; Link/Contato: https://octopart.com/erj-3ekf1000v-panasonic-55403645?r=sp; Supplier: Mouser
R53 R83 = Pullup_Res_100K_0603_RES: Thick Film Resistors - SMD 10 kOhms 100-200 mW 0603 1%; MPN: RC0603FR-1310KL; Manufacturer: Yageo; PCBA: DNA; Moeda: Dólar; NCM: 85332120; Datasheet: https://www.mouser.com/datasheet/2/427/crcwce3-1223726.pdf; Value: 10K; Link/Contato: https://octopart.com/rc0603fr-1310kl-yageo-11543875?r=sp; Supplier: Mouser
R60 R61 = Res_3: Thin Film Resistors - SMD 22Ohms 0603 100mW 1%; MPN: RT0603FRE0722RL; Manufacturer: Yageo; PCBA: Assembly; Moeda: Dólar; NCM: 85332120; Value: 22R; Link/Contato: https://octopart.com/rt0603fre0722rl-yageo-39814074?r=sp; Supplier: Mouser
R63 R65 R67 R75 = Pullup_Res_0_0603_RES: as R25 on sheet Pag2_Battery_Charger; Datasheet: https://www.mouser.com/datasheet/2/447/PYu-RC_Group_51_RoHS_L_10-1527934.pdf; Value: 0R; Link/Contato: https://octopart.com/rc0603jr-070rl-yageo-1241539?r=sp; Supplier: Mouser
R71 R73 = Res: Thick Film Resistors - SMD 1 kOhms 100 mW 0603 5%; Manufacturer: Yageo; MPN: RC0603JR-071KL; Moeda: Dólar; NCM: 85332120; Datasheet: https://www.mouser.com/datasheet/2/447/PYu-RT_1-to-0.01_RoHS_L_9-1222720.pdf; Value: 1K; Link/Contato: https://octopart.com/rc0603jr-071kl-yageo-55402888?r=sp; Supplier: Mouser
R72 = Pullup_Res_100K_0603_RES: Thick Film Resistors - SMD 100 kOhms 0603 100mW 1%; MPN: RC0603FR-07100KL; Manufacturer: Yageo; Moeda: Dólar; NCM: 85332120; Datasheet: https://www.mouser.com/datasheet/2/447/PYu-RC_Group_51_RoHS_L_10-1527934.pdf; Value: 100K; Link/Contato: https://octopart.com/rc0603fr-07100kl-yageo-40946036?r=sp; Supplier: Mouser
TP21-TP27 TP29 TP31-TP35 = TESTPOINT: MPN: Test_Point; Manufacturer: DNA; PCBA: DNA; Value: Test Point
Y1 = 407F35E016M3840: Crystal or Oscillator; Manufacturer: CTS Electronic Components; PCBA: Assembly; Moeda: Dólar; NCM: 85416010; Value: 407F35E016M3840; MPN: 407F35E016M3840; Datasheet: http://www.ctscorp.com/wp-content/uploads/407.pdf; Link/Contato: https://octopart.com/407f35e016m3840-cts+components-2428554?r=sp; Supplier: Mouser

## Sheet Pag4_Processador.SchDoc
size A4
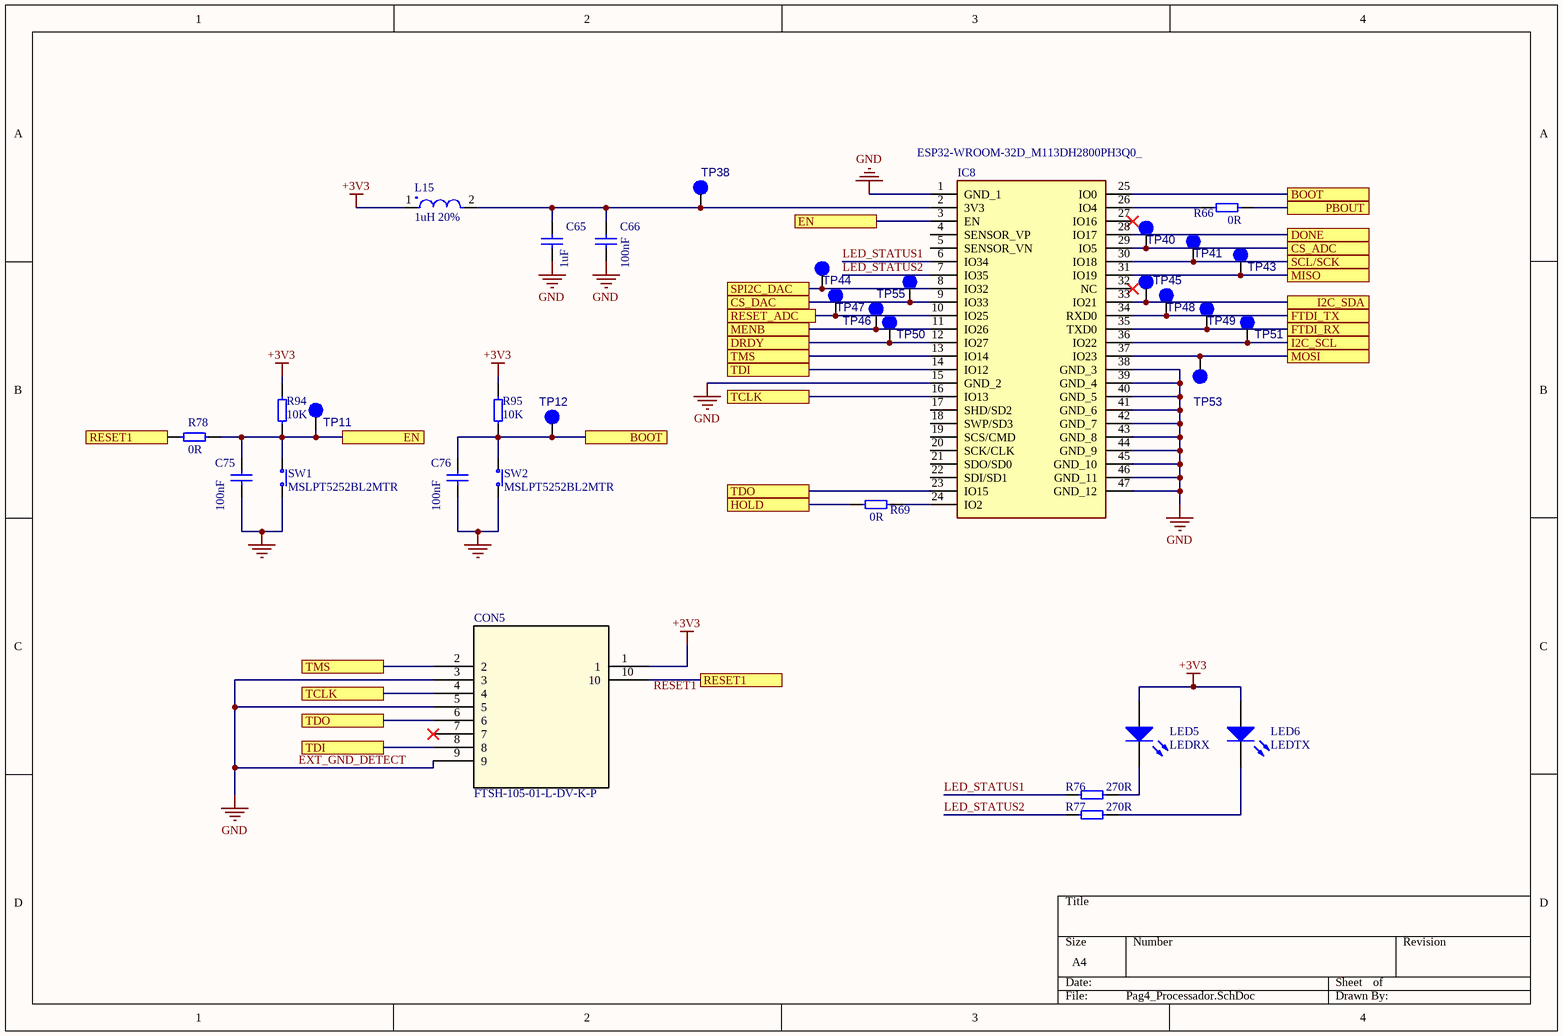
[diagram p3: Pag4_Processador.SchDoc]

### Parts
C65  1uF  [0603]
C66  100nF  [0603]
C75  100nF  [0603]
C76  100nF  [0603]
CON5  FTSH-105-01-L-DV-K-P  [SAMTEC_FTSH-105-XX-X-DV]
IC8  ESP32-WROOM-32D_M113DH2800PH3Q0_  [ESP32WROOM32DM113DH2800PH3Q0]
L15  1uH 20%  [SRP4020-1R5M]
LED5  LEDRX  [0603 - LED]
LED6  LEDTX  [0603 - LED]
R66  0R  [0603]
R69  0R  [0603]
R76  270R  [0603_2]
R77  270R  [0603_2]
R78  0R  [0603]
R94  10K  [0603]
R95  10K  [0603]
SW1  MSLPT5252BL2MTR  [MSLPT5252BG1MTR_pullup]
SW2  MSLPT5252BL2MTR  [MSLPT5252BG1MTR_pullup]
TP11  Test Point  [TEST]  (value not drawn)
TP12  Test Point  [TEST]  (value not drawn)
TP38  Test Point  [TEST]  (value not drawn)
TP40  Test Point  [TEST]  (value not drawn)
TP41  Test Point  [TEST]  (value not drawn)
TP43  Test Point  [TEST]  (value not drawn)
TP44  Test Point  [TEST]  (value not drawn)
TP45  Test Point  [TEST]  (value not drawn)
TP46  Test Point  [TEST]  (value not drawn)
TP47  Test Point  [TEST]  (value not drawn)
TP48  Test Point  [TEST]  (value not drawn)
TP49  Test Point  [TEST]  (value not drawn)
TP50  Test Point  [TEST]  (value not drawn)
TP51  Test Point  [TEST]  (value not drawn)
TP53  Test Point  [TEST]  (value not drawn)
TP55  Test Point  [TEST]  (value not drawn)

### Ports
BOOT, CS_ADC, CS_DAC, DONE, DRDY, EN, FTDI_RX, FTDI_TX, HOLD, I2C_SCL, I2C_SDA, MENB, MISO, MOSI, PBOUT, RESET1, RESET_ADC, SCL/SCK, SPI2C_DAC, TCLK, TDI, TDO, TMS

### Nets
+3V3: CON5.1 L15.1 LED5.1(A) LED6.1(A) R94.2 R95.2
EXT_GND_DETECT: C65.1 C66.1 C75.1 C76.1 CON5.3 CON5.5 CON5.9 IC8.1(GND_1) IC8.15(GND_2) IC8.38(GND_3) IC8.39(GND_4) IC8.40(GND_5) IC8.41(GND_6) IC8.42(GND_7) IC8.43(GND_8) IC8.44(GND_9) IC8.45(GND_10) IC8.46(GND_11) IC8.47(GND_12) SW1.1(N.O) SW2.1(N.O)  [also labelled GND]
I2C_SCL: IC8.36(IO22) TP51.1(TP) ; port I2C_SCL
I2C_SDA: IC8.33(IO21) TP45.1(TP) ; port I2C_SDA
LED_STATUS1: IC8.6(IO34) R76.1
LED_STATUS2: IC8.7(IO35) R77.1
NetC65_2: C65.2 C66.2 IC8.2(3V3) L15.2 TP38.1(TP)
NetC75_2: C75.2 IC8.3(EN) R78.1 R94.1 SW1.2(COM) TP11.1(TP) ; port EN
NetC76_2: C76.2 IC8.25(IO0) R95.1 SW2.2(COM) TP12.1(TP) ; port BOOT
NetCON5_2: CON5.2 IC8.13(IO14) ; port TMS
NetCON5_4: CON5.4 IC8.16(IO13) ; port TCLK
NetCON5_6: CON5.6 IC8.23(IO15) ; port TDO
NetCON5_8: CON5.8 IC8.14(IO12) ; port TDI
NetCON5_10: CON5.10 R78.2 ; port RESET1
NetD2_A: R66.1 ; port PBOUT
NetIC3_5: IC8.8(IO32) TP44.1(TP) ; port SPI2C_DAC
NetIC3_6: IC8.30(IO18) TP41.1(TP) ; port SCL/SCK
NetIC3_7: IC8.9(IO33) TP55.1(TP) ; port CS_DAC
NetIC3_8: IC8.37(IO23) TP53.1(TP) ; port MOSI
NetIC4_17: IC8.10(IO25) TP47.1(TP) ; port RESET_ADC
NetIC4_18: IC8.28(IO17) ; port DONE
NetIC4_19: IC8.12(IO27) TP50.1(TP) ; port DRDY
NetIC4_21: IC8.31(IO19) TP43.1(TP) ; port MISO
NetIC4_23: IC8.29(IO5) TP40.1(TP) ; port CS_ADC
NetIC8_11: IC8.11(IO26) TP46.1(TP) ; port MENB
NetIC8_24: IC8.24(IO2) R69.1
NetIC8_26: IC8.26(IO4) R66.2
NetIC8_34: IC8.34(RXD0) TP48.1(TP) ; port FTDI_TX
NetIC8_35: IC8.35(TXD0) TP49.1(TP) ; port FTDI_RX
NetLED5_2: LED5.2(K) R76.2
NetLED6_2: LED6.2(K) R77.2
NetR16_2: R69.2 ; port HOLD

Not connected (* = marked no-connect by the designer): CON5 7*; IC8 4(SENSOR_VP) 5(SENSOR_VN) 17(SHD/SD2) 18(SWP/SD3) 19(SCS/CMD) 20(SCK/CLK) 21(SDO/SD0) 22(SDI/SD1) 27(IO16)* 32(NC)*

### Notes on the sheet
- Labels drawn without touching a wire or pin: RESET1

### Library data of the parts
C65 = CAP_1uF: as C11 on sheet Pag1_PowerSupply; Datasheet: https://www.mouser.com/datasheet/2/585/MLCC-1837944.pdf; Value: 1uF; Link/Contato: https://octopart.com/cl10a105ka8nnnc-samsung-9300957?r=sp; Supplier: Mouser
C66 C75 C76 = Cap_1: as C8 on sheet Pag1_PowerSupply; Value: 100nF; Link/Contato: https://octopart.com/c0603c104k4ractu-kemet-93067?r=sp; Supplier: Mouser
CON5 = FTSH-105-01-L-DV-K-P: No Description Available; Manufacturer: Samtec; MPN: FTSH-105-01-L-DV-K-P-TR; PCBA: Assembly; Moeda: Dólar; NCM: 85366990; Datasheet: https://www.mouser.com/datasheet/2/527/ftsh_smt-1316912.pdf; Value: FTSH-105-01-L-DV-K-P; Link/Contato: https://octopart.com/ftsh-105-01-l-dv-k-p-tr-samtec-7458850?r=sp; Supplier: Mouser
IC8 = ESP32-WROOM-32D_M113DH2800PH3Q0_: Integrated Circuit; Manufacturer: Espressif Systems; MPN: ESP32-WROOM-32D(M113DH2800PH3Q0); PCBA: Assembly; Moeda: Dólar; NCM: 85423120; Observações: Alternativo: ESP32-WROOM-32E-N16; Value: ESP32-WROOM-32D_M113DH2800PH3Q0_; Datasheet: https://www.espressif.com/sites/default/files/documentation/esp32-wroom-32d_esp32-wroom-32u_datasheet_en.pdf; Link/Contato: https://octopart.com/esp32-wroom-32d%28m113dh2800ph3q0%29-espressif+systems-109490844?r=sp; Supplier: Mouser
L15 = IC_1uH: Power Inductors - SMD 1uH 20% SMD 4012 AEC-Q200; Manufacturer: Bourns; MPN: SRP4012TA-1R0M; PCBA: Assembly; Moeda: Dólar; NCM: 85045000; Datasheet: https://www.mouser.com/datasheet/2/54/rp4012ta-1391620.pdf; Value: 1uH 20%; Link/Contato: https://octopart.com/srp4012ta-1r0m-bourns-47284976?r=sp; Supplier: Mouser
LED5 LED6 = LED: Standard LEDs - SMD 0603 SMT CHIP LED 572nm; Manufacturer: ROHM Semiconductor; MPN: SML-D13M8WT86; PCBA: Assembly; Moeda: Dólar; NCM: 85414121; Link/Contato: https://octopart.com/sml-d13m8wt86-rohm-24399183?r=sp; Supplier: Mouser
  LED5: Value: LEDRX
  LED6: Value: LEDTX
R66 R69 R78 = Pullup_Res_0_0603_RES: Thick Film Resistors - SMD 0 Ohms 100 mW 0603 5%; MPN: RC0603JR-070RL; Manufacturer: Yageo; PCBA: DNA; Moeda: Dólar; NCM: 85332120; Datasheet: https://www.mouser.com/datasheet/2/447/PYu-RC_Group_51_RoHS_L_10-1527934.pdf; Value: 0R; Link/Contato: https://octopart.com/rc0603jr-070rl-yageo-1241539?r=sp; Supplier: Mouser
R76 R77 = Res: Thick Film Resistors - SMD 270 Ohms 0603 100mW 1%; Manufacturer: Yageo; MPN: RC0603FR-07270RL; PCBA: Assembly; Moeda: Dólar; NCM: 85332120; Value: 270R; Link/Contato: https://octopart.com/rc0603fr-07270rl-yageo-9288890?r=sp; Supplier: Mouser
R94 R95 = Pullup_Res_100K_0603_RES: as R37 on sheet Pag3_Front_end_adc_dac; Datasheet: https://www.mouser.com/datasheet/2/427/crcwce3-1223726.pdf; Value: 10K; Link/Contato: https://octopart.com/rc0603fr-1310kl-yageo-11543875?r=sp; Supplier: Mouser
SW1 SW2 = Switch-PB-6.2x6.3mm-SMD: Tactile Switch, SPNO, SMD, 160gf, 6.2x6.3x2.5mm; Manufacturer: TE Connectivity / Alcoswitch; PCBA: Assembly; Moeda: Dólar; NCM: 85365090; MPN: MSLPT5252BL2MTR; Link/Contato: https://octopart.com/mslpt5252bl2mtr-te+connectivity+%2F+alcoswitch-96493489?r=sp; Supplier: Mouser
  SW1: Value: MSLPT5252BL2MTR
TP11 TP12 TP38 TP40 TP41 TP43-TP51 TP53 TP55 = TESTPOINT: MPN: Test_Point; Manufacturer: DNA; PCBA: DNA; Value: Test Point

## Sheet Pag5_Perifericos.SchDoc
size A4
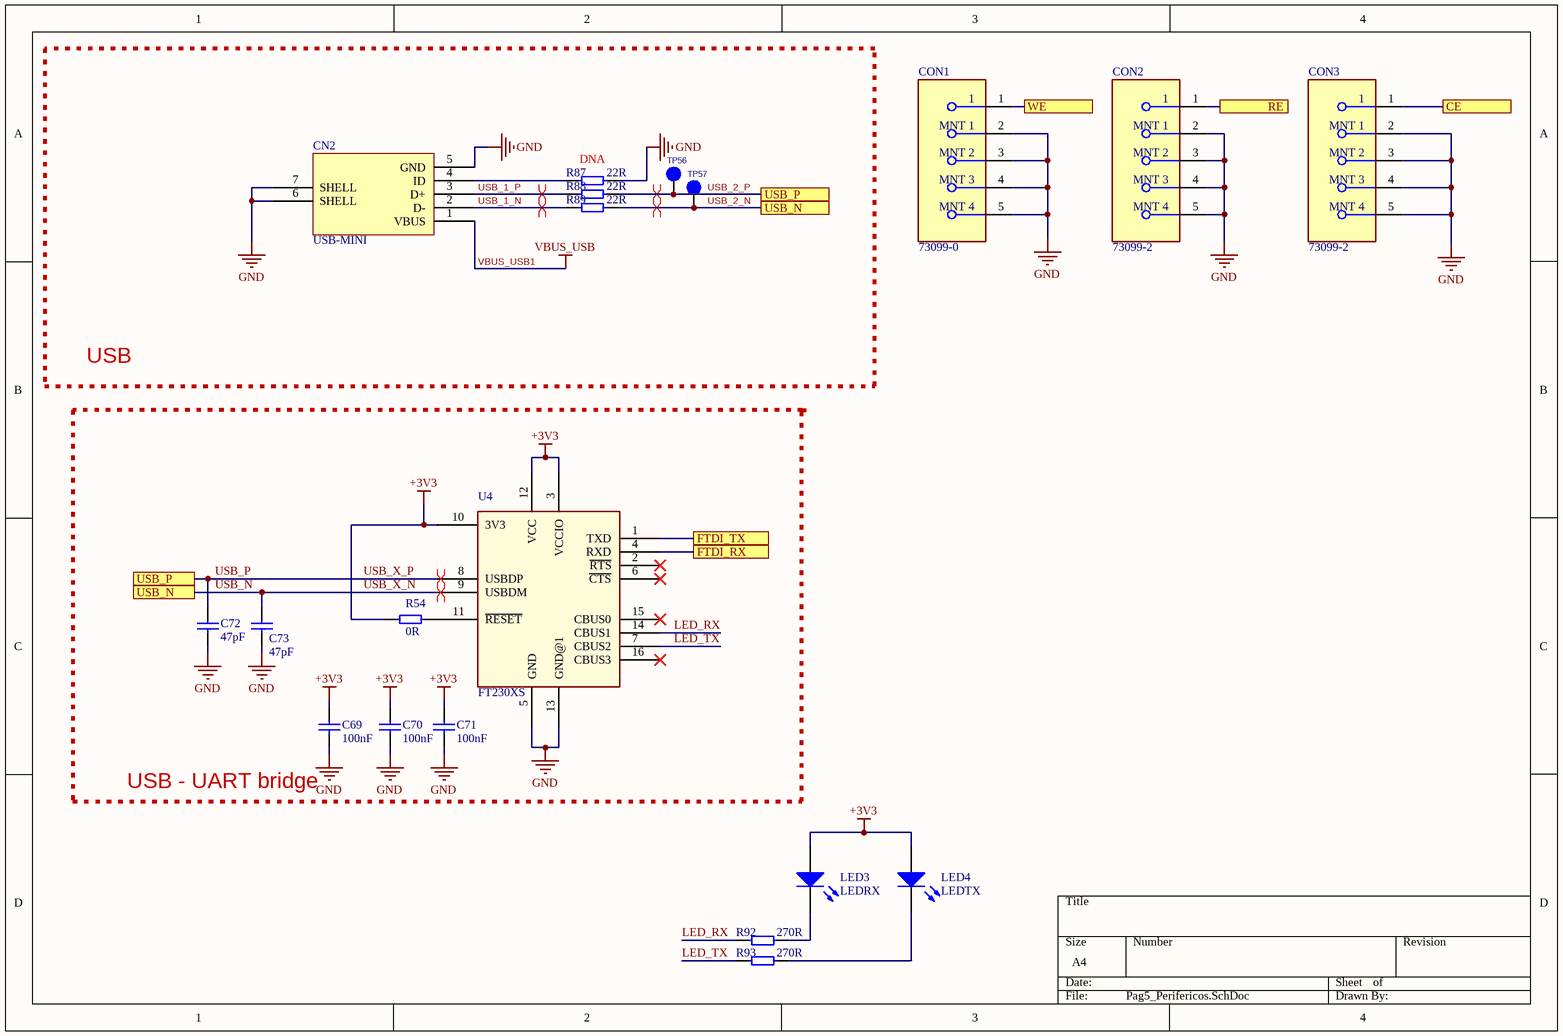
[diagram p4: Pag5_Perifericos.SchDoc]

### Parts
C69  100nF  [0603]
C70  100nF  [0603]
C71  100nF  [0603]
C72  47pF  [0603]
C73  47pF  [0603]
CN2  USB-MINI  [TE_2172034-1]
CON1  73099-0  [FP-73099-0-MFG]
CON2  73099-2  [FP-73099-2-MFG]
CON3  73099-2  [FP-73099-2-MFG]
LED3  LEDRX  [0603 - LED]
LED4  LEDTX  [0603 - LED]
R54  0R  [0603]
R87  22R  PCBA: DNA  [0603]
R88  22R  [0603]
R89  22R  [0603]
R92  270R  [0603]
R93  270R  [0603]
TP56  Test_Point  [TEST]  (value not drawn)
TP57  Test_Point  [TEST]  (value not drawn)
U4  FT230XS  [SSOP-16-2]

### Blocks framed on the sheet
USB: CN2 R87-R89 TP56 TP57

### Ports
CE, FTDI_RX, FTDI_TX, RE, USB_N, USB_P, WE

### Nets
+3V3: C69.2 C70.2 C71.2 LED3.1(A) LED4.1(A) R54.2 U4.3(VCCIO) U4.10(3V3) U4.12(VCC)
GND: C69.1 C70.1 C71.1 C72.1 C73.1 CN2.5(GND) CN2.6(SHELL) CN2.7(SHELL) CON1.2(MNT_1) CON1.3(MNT_2) CON1.4(MNT_3) CON1.5(MNT_4) CON2.2(MNT_1) CON2.3(MNT_2) CON2.4(MNT_3) CON2.5(MNT_4) CON3.2(MNT_1) CON3.3(MNT_2) CON3.4(MNT_3) CON3.5(MNT_4) R87.1 U4.5(GND) U4.13(GND@1)  [project net EXT_GND_DETECT]
VBUS_USB1: CN2.1(VBUS)  [also labelled VBUS_USB]
LED_RX: R92.1 U4.14(CBUS1)
LED_TX: R93.1 U4.7(CBUS2)
USB_1_N: CN2.2(D-) R89.2
USB_1_P: CN2.3(D+) R88.2
USB_2_N: C73.2 R89.1 TP57.1(Pin1) U4.9(USBDM) ; port USB_N  [also labelled USB_N, USB_X_N]
USB_2_P: C72.2 R88.1 TP56.1(Pin1) U4.8(USBDP) ; port USB_P  [also labelled USB_P, USB_X_P]
NetCN2_4: CN2.4(ID) R87.2
NetCN3_1: CON2.1 ; port RE
NetCN3_2: CON1.1 ; port WE
NetCN3_3: CON3.1 ; port CE
NetIC8_34: U4.1(TXD) ; port FTDI_TX
NetIC8_35: U4.4(RXD) ; port FTDI_RX
NetLED3_2: LED3.2(K) R92.2
NetLED4_2: LED4.2(K) R93.2
NetR54_1: R54.1 U4.11(~{RESET})

Not connected (* = marked no-connect by the designer): U4 2(~{RTS})* 6(~{CTS})* 15(CBUS0)* 16(CBUS3)*

### Layout directives
differential pair: USB_1_N, USB_1_P, USB_2_N, USB_2_P

### Notes on the sheet
- (near C69) USB - UART bridge

### Library data of the parts
C69-C71 = Cap: Multilayer Ceramic Capacitors MLCC - SMD/SMT 100nF 16V 0603 10%; Manufacturer: KEMET; MPN: C0603C104K4RACTU; PCBA: Assembly; Moeda: Dólar; NCM: 85322410; Value: 100nF; Link/Contato: https://octopart.com/c0603c104k4ractu-kemet-93067?r=sp; Supplier: Mouser
C72 C73 = Cap: Multilayer Ceramic Capacitors MLCC - SMD/SMT 47pF 0603 25V 5%; Manufacturer: Vishay; MPN: VJ0603A470JXXPW1BC; PCBA: Assembly; Moeda: Dólar; NCM: 85322410; Value: 47pF; Link/Contato: https://octopart.com/vj0603a470jxxpw1bc-vishay-40999950?r=sp; Supplier: Mouser
CN2 = USB-MINI: Standard LEDs - SMD 0603 SMT CHIP LED 572nm; MPN: 2172034-1; Manufacturer: TE Connectivity AMP Connectors; PCBA: Assembly; Moeda: Dólar; NCM: 85366990; Datasheet: https://www.te.com/commerce/DocumentDelivery/DDEController?Action=srchrtrv&DocNm=2172034&DocType=Customer+Drawing&DocLang=English; Value: USB-MINI; Link/Contato: https://octopart.com/2172034-1-te+connectivity+%2F+amp-34548161?r=sp; Supplier: Mouser
CON1 = CMP-73906-000007-1: R/A 4MM MOUNTG SAFE JACK/PCB BLK; Manufacturer: Pomona Electronics; PCBA: Assembly; Moeda: Dólar; NCM: 85366990; Value: 73099-0; MPN: 73099-0; Link/Contato: https://octopart.com/73099-0-pomona+electronics-104944164?r=sp; Supplier: Mouser
CON2 CON3 = CMP-73906-000005-1: R/A 4MM MOUNTG SAFE JACK/PCB RED; Manufacturer: Pomona Electronics; PCBA: Assembly; Moeda: Dólar; NCM: 85366990; Value: 73099-2; MPN: 73099-2; Link/Contato: https://octopart.com/73099-2-pomona+electronics-104944165?r=sp; Supplier: Mouser
LED3 LED4 = LED: as LED5 on sheet Pag4_Processador; Link/Contato: https://octopart.com/sml-d13m8wt86-rohm-24399183?r=sp; Supplier: Mouser
  LED3: Value: LEDRX
  LED4: Value: LEDTX
R54 = Pullup_Res_0_0603_RES: as R17 on sheet Pag2_Battery_Charger; Datasheet: https://www.mouser.com/datasheet/2/447/PYu-RC_Group_51_RoHS_L_10-1527934.pdf; Value: 0R; Link/Contato: https://octopart.com/rc0603jr-070rl-yageo-1241539?r=sp; Supplier: Mouser
R87 = Res: Thin Film Resistors - SMD 22Ohms 0603 100mW 1%; Manufacturer: Yageo; MPN: RT0603FRE0722RL; Moeda: Dólar; NCM: 85332120; Datasheet: https://www.mouser.com/datasheet/2/447/PYu-RC_Group_51_RoHS_L_10-1527934.pdf; Value: 22R; Link/Contato: https://octopart.com/rt0603fre0722rl-yageo-39814074?r=sp; Supplier: Mouser
R88 R89 = Res: Thin Film Resistors - SMD 22Ohms 0603 100mW 1%; Manufacturer: Yageo; MPN: RT0603FRE0722RL; PCBA: Assembly; Moeda: Dólar; NCM: 85332120; Datasheet: https://www.mouser.com/datasheet/2/447/PYu-RT_1-to-0.01_RoHS_L_9-1222720.pdf; Value: 22R; Link/Contato: https://octopart.com/rt0603fre0722rl-yageo-39814074?r=sp; Supplier: Mouser
R92 R93 = Res: as R76 on sheet Pag4_Processador; Value: 270R; Link/Contato: https://octopart.com/rc0603fr-07270rl-yageo-9288890?r=sp; Supplier: Mouser
TP56 TP57 = CDO08200-9892: Manufacturer: DNA; Value: Test Point; MPN: Test_Point; PCBA: DNA
U4 = FT230XS: I/F, USB2.0 FS TO BASIC UART, 16SSOP; USB Type: Transceiver; USB Version: 2.0; Data Rate: 3Mbaud; Supply Voltage Rang...; Manufacturer: FTDI; PCBA: Assembly; Moeda: Dólar; NCM: 85423120; MPN: FT230XS; Value: FT230XS; Link/Contato: https://octopart.com/ft230xs-r-ftdi-22061505?r=sp; Supplier: Mouser